# EasyEDA Pro project PCB-PockerMultimater1.epro, board PCB-PockerMultimater1
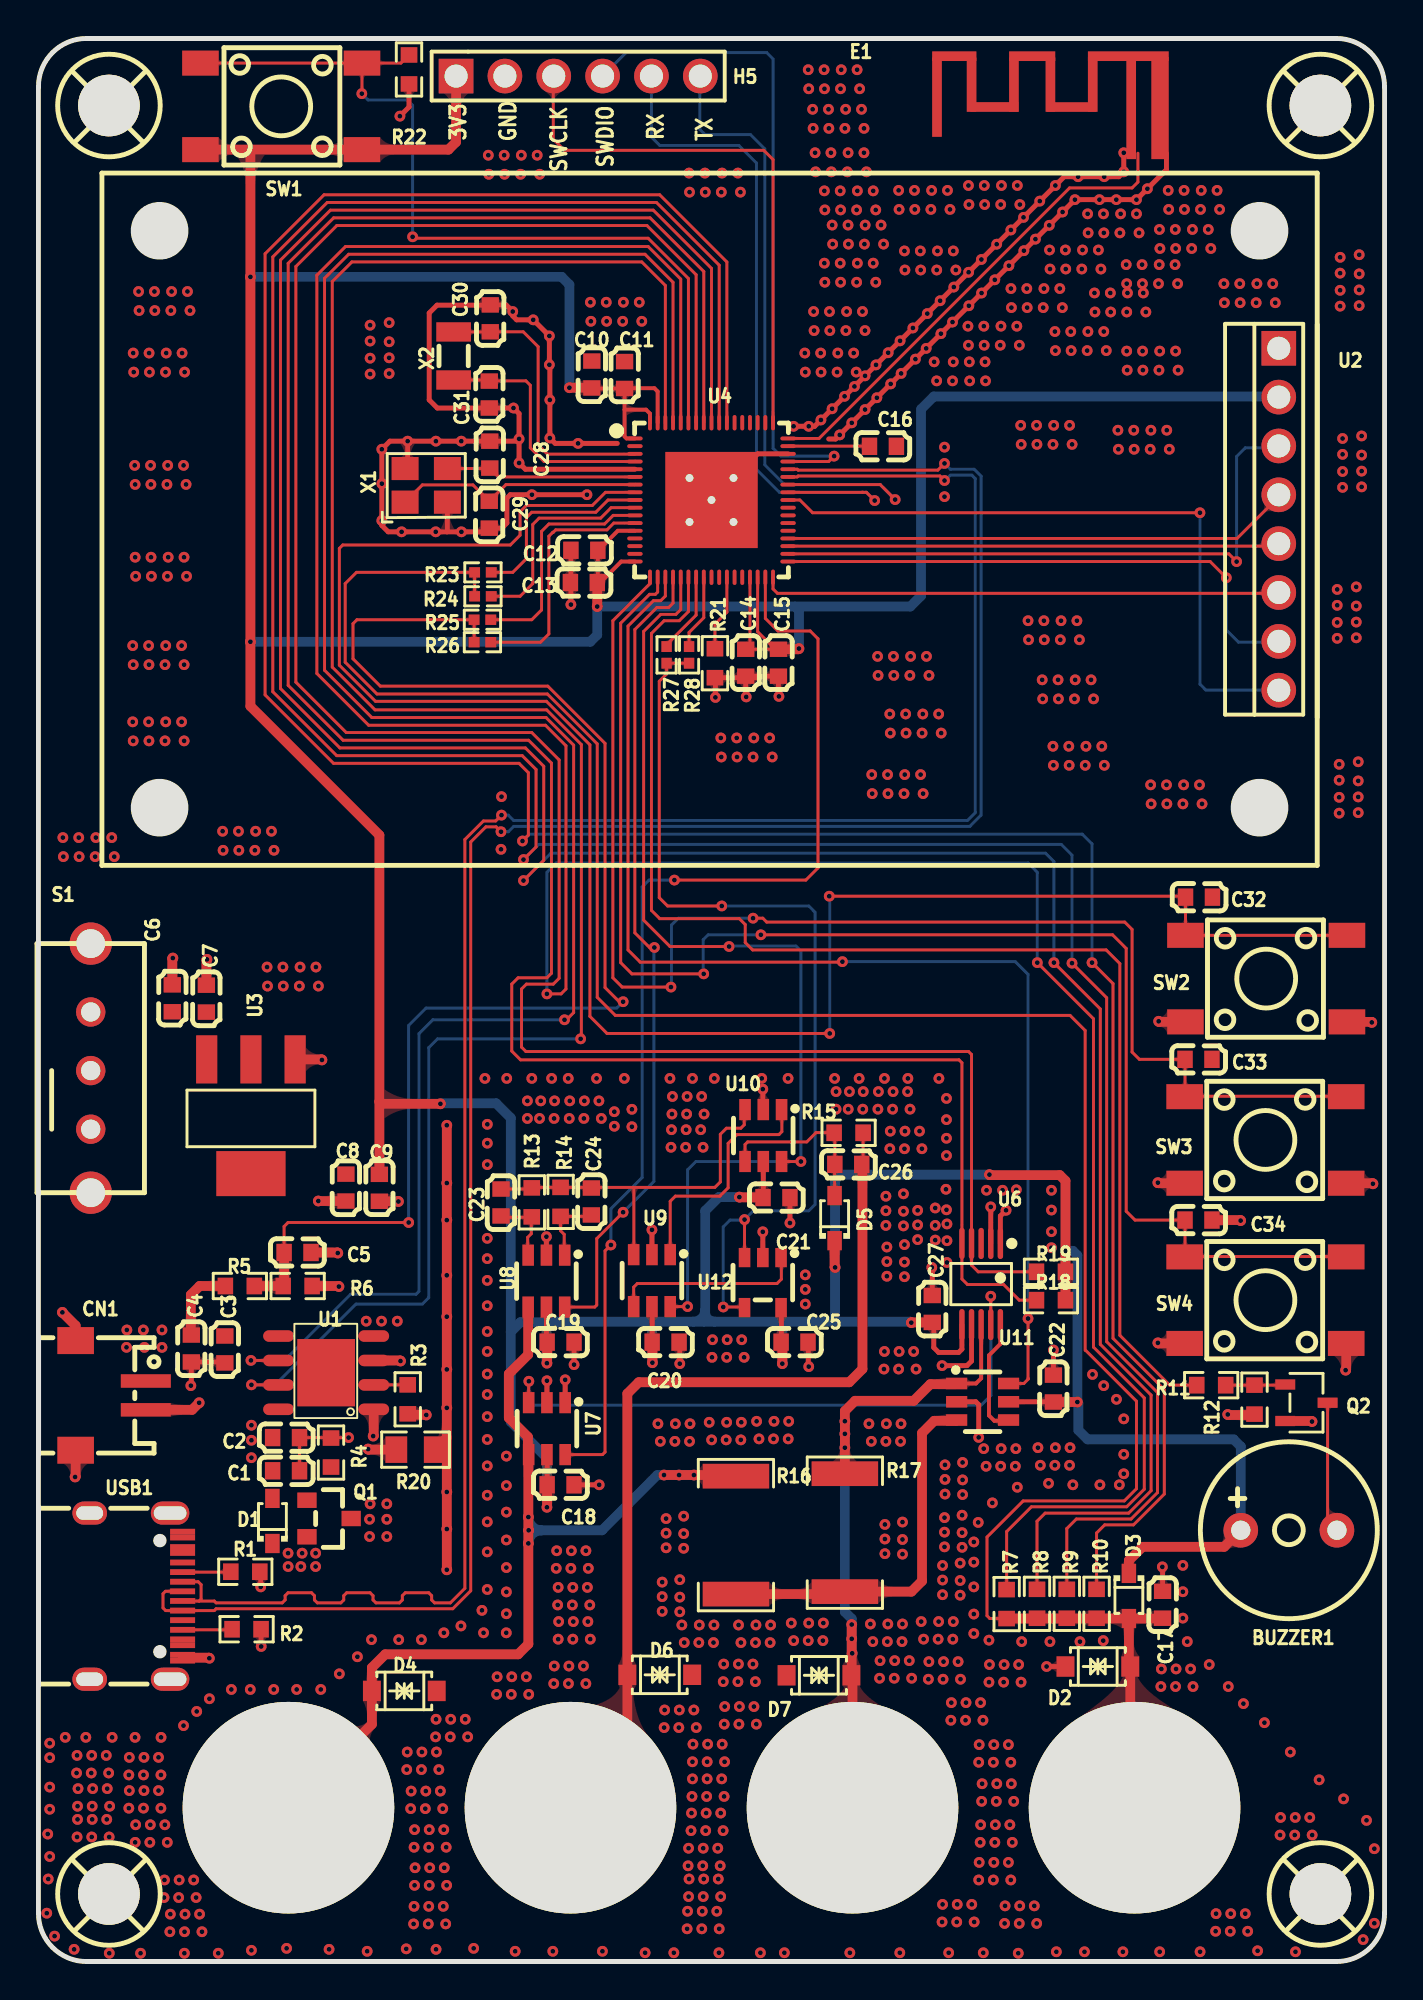
[diagram p0: board, top side]
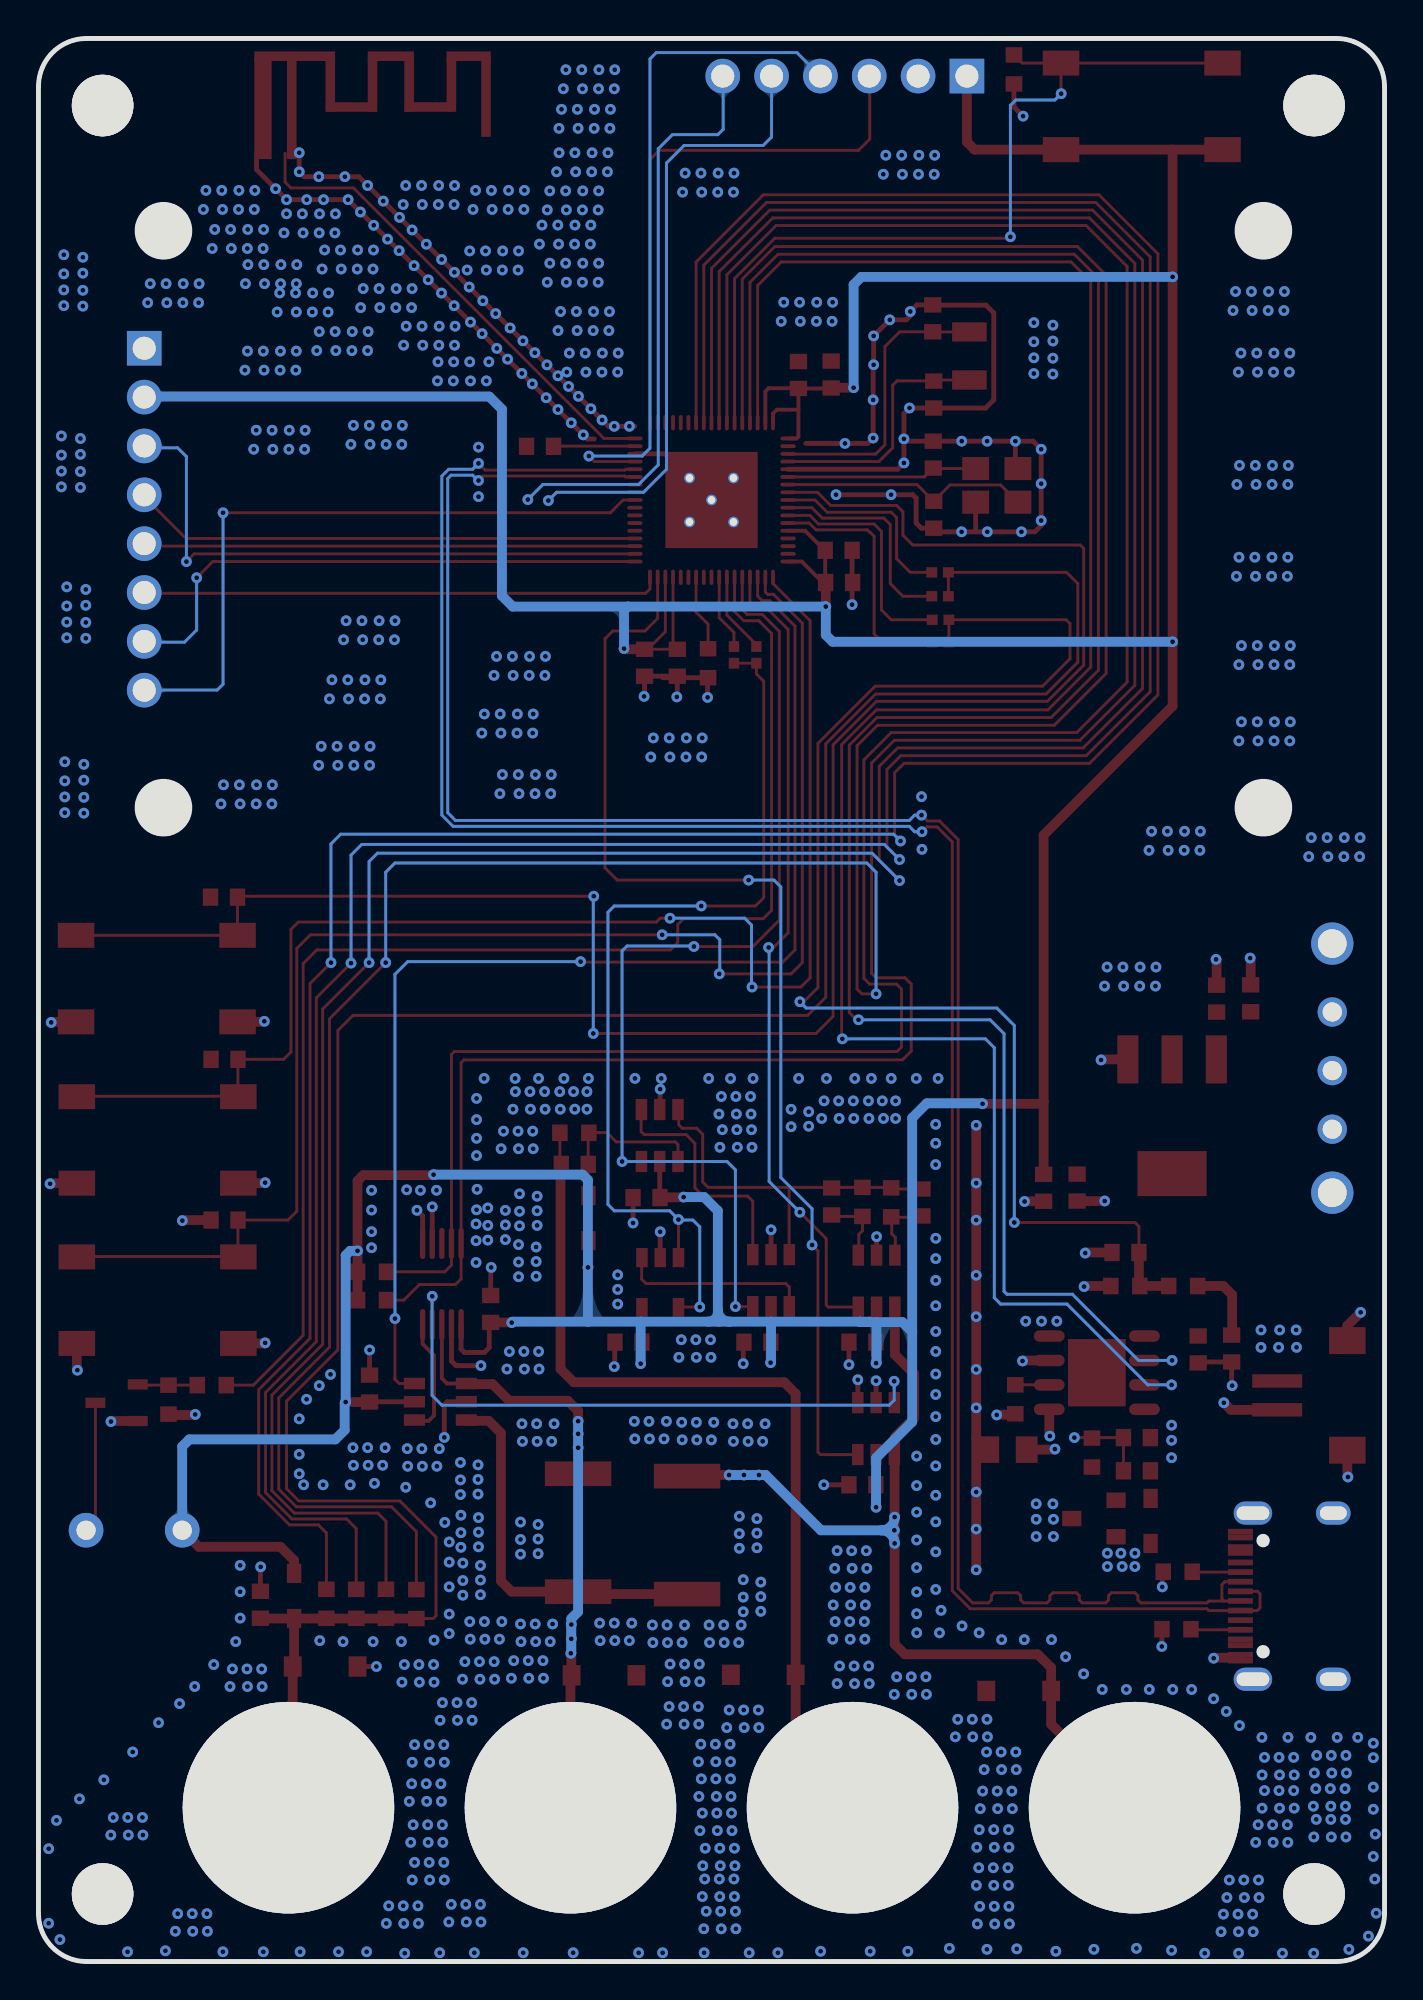
[diagram p1: board, bottom side, seen from below]

Outline 70 x 100 mm; copper layers: Top Layer, Bottom Layer. Coordinates in mm from the lower left corner of the outline.
Outline path: 0,97.5 0,2.5 arc(0.73,0.73) 2.5,0 67.5,0 arc(69.27,0.73) 70,2.5 70,97.5 arc(69.27,99.27) 67.5,100 2.5,100 arc(0.73,99.27) 0,97.5
Stack: Top Layer 0.035mm / Dielectric1 1.51mm FR4 er 4.5 / Bottom Layer 0.035mm

## Design rules (mm)
net VIN: power
net GND: power
net VBUS: power
net USB1DM: DP1
net USB1DP: DP1
net 3V3: power
net VBAT: power
net +5V: power
net AGND: power
template: 自定义配置
spacing copperThickness1oz (default): track to track 0.152, other pairs 0.152 to 0.152
spacing copperThickness2oz: track to track 0.203, other pairs 0.152 to 0.3
spacing ANT: track to track 0.152, other pairs 0 to 0.3
track width copperThickness1oz (default): min 0.152, default 0.152, max 2.54
track width copperThickness2oz: min 0.203, default 0.254, max 2.54
track width power: min 0.152, default 0.254, max 2.54
differential pair differentialPair (default): width min 0.152, default 0.152, max 0.152; gap min 0.152, default 0.152
via viaSize (default): diameter min 0.559, default 0.559, max 0.559; hole min 0.254, default 0.254, max 0.254
net class power uses power
net VIN uses power
net GND uses power
net VBUS uses power
net 3V3 uses power
net VBAT uses power
net +5V uses power
net AGND uses power

## Placement (name value [footprint] x y rotation side)
BUZZER1  3kHz  [BUZ-TH_BD9.0-P5.00-D0.6-FD]  65.02 22.43 0 top
C1  10uF  [C0603]  12.88 25.52 180 top
C2  100nF  [C0603]  12.88 27.25 180 top
C3  10uF  [C0603]  9.69 31.83 90 top
C4  100nF  [C0603]  7.95 31.88 90 top
C5  100nF  [C0603]  13.47 36.87 0 top
C6  10uF  [C0603]  6.96 50.09 270 top
C7  100nF  [C0603]  8.73 50.07 90 top
C8  10uF  [C0603]  15.99 40.25 90 top
C9  100nF  [C0603]  17.73 40.23 270 top
C10  100nF  [C0603]  28.78 82.52 90 top
C11  100nF  [C0603]  30.48 82.5 270 top
C12  100nF  [C0603]  28.39 73.39 180 top
C13  100nF  [C0603]  28.36 71.71 180 top
C14  100nF  [C0603]  36.78 67.54 270 top
C15  100nF  [C0603]  38.48 67.54 270 top
C16  1uF  [C0603]  43.92 78.79 0 top
C17  100nF  [C0603]  58.46 18.55 270 top
C18  100nF  [C0603]  27.15 24.79 0 top
C19  100nF  [C0603]  27.15 32.21 0 top
C20  100nF  [C0603]  32.61 32.21 0 top
C21  100nF  [C0603]  38.38 39.73 0 top
C22  100nF  [C0603]  52.78 29.79 90 top
C23  100nF  [C0603]  24.05 39.47 90 top
C24  100nF  [C0603]  28.75 39.52 90 top
C25  100nF  [C0603]  39.32 32.21 0 top
C26  100nF  [C0603]  42.11 41.45 180 top
C27  100nF  [C0603]  46.48 33.93 90 top
C28  12pF  [C0603]  23.47 78.36 90 top
C29  12pF  [C0603]  23.44 75.23 90 top
C30  12pF  [C0603]  23.5 85.45 90 top
C31  12pF  [C0603]  23.44 81.48 270 top
C32  100nF  [C0603]  60.35 55.35 180 top
C33  100nF  [C0603]  60.32 46.91 180 top
C34  100nF  [C0603]  60.32 38.56 180 top
CN1  1.5K-BH-2PWB  [CONN-SMD_2P-P1.50_HDGC_1.5K-BH-2PWB]  3.76 29.44 270 top
D1  1N5819WS  [SOD-323_L1.8-W1.3-LS2.5-RD]  12.17 22.91 90 top
D2  SJD12C40L01  [SOD-123_L2.8-W1.8-LS3.7-BI]  55.09 15.34 0 top
D3  1N4148  [SOD-323_L1.8-W1.3-LS2.5-RD]  56.71 19.01 270 top
D4  SJD12C40L01  [SOD-123_L2.8-W1.8-LS3.7-BI]  19.02 14.07 180 top
D5  1N4148  [SOD-323_L1.8-W1.3-LS2.5-RD]  41.4 38.66 90 top
D6  SJD12C40L01  [SOD-123_L2.8-W1.8-LS3.7-BI]  32.31 14.91 180 top
D7  SJD12C40L01  [SOD-123_L2.8-W1.8-LS3.7-BI]  40.59 14.88 0 top
E1  d62bb7b376ef4f1495932ffa50be4b9b  [ANT-F-1-2.4G-1.6]  57.18 94.03 0 top
H1  -  [M3]  3.5 96.5 0 top
H2  -  [M3]  66.5 96.5 0 top
H3  -  [M3]  3.5 3.5 0 top
H4  -  [M3]  66.5 3.5 0 top
H5  2.54-1x6P直针  [HDR-TH_6P-P2.54-V-M-1]  28.07 98.04 0 top
J1  -  [香蕉头-4mm-24.302.*]  13 8 0 top
J2  -  [香蕉头-4mm-24.302.*]  27.67 8 0 top
J3  -  [香蕉头-4mm-24.302.*]  42.33 8 0 top
J4  -  [香蕉头-4mm-24.302.*]  57 8 0 top
Q1  AO3401A  [SOT-23_L2.9-W1.3-P1.90-LS2.4-BR]  15.11 23.04 180 top
Q2  S8050  [SOT-23-3_L3.0-W1.7-P0.95-LS2.9-BR]  65.94 29.06 180 top
R1  5.1kΩ  [R0603]  10.76 20.27 180 top
R2  5.1kΩ  [R0603]  10.82 17.28 180 top
R3  10kΩ  [R0603]  19.2 29.24 90 top
R4  10kΩ  [R0603]  15.21 26.47 270 top
R5  10kΩ  [R0603]  10.47 35.13 180 top
R6  10kΩ  [R0603]  13.48 35.13 180 top
R7  1kΩ  [R0603]  50.35 18.59 90 top
R8  10kΩ  [R0603]  51.93 18.6 90 top
R9  100kΩ  [R0603]  53.48 18.6 90 top
R10  1MΩ  [R0603]  55.03 18.6 90 top
R11  10kΩ  [R0603]  60.99 29.97 0 top
R12  10kΩ  [R0603]  63.24 29.22 90 top
R13  100kΩ  [R0603]  25.65 39.48 90 top
R14  1MΩ  [R0603]  27.15 39.5 90 top
R15  1MΩ  [R0603]  42.13 43.09 180 top
R16  10mΩ  [R2512]  36.27 22.17 90 top
R17  80mΩ  [R2512]  41.94 22.3 270 top
R18  4.7kΩ  [R0603]  52.65 34.39 0 top
R19  4.7kΩ  [R0603]  52.65 35.86 0 top
R20  0Ω  [R0805]  19.61 26.62 180 top
R21  10kΩ  [R0603]  35.18 67.51 270 top
R22  10kΩ  [R0603]  19.27 98.39 270 top
R23  0Ω  [R0402]  23.11 72.24 0 top
R24  0Ω  [R0402]  23.11 70.99 0 top
R25  0Ω  [R0402]  23.09 69.77 0 top
R26  0Ω  [R0402]  23.09 68.61 0 top
R27  0Ω  [R0402]  32.66 67.94 90 top
R28  0Ω  [R0402]  33.83 67.94 90 top
S1  SK-12E12-G5  [SW-TH_SK-12E12-G5]  2.72 46.46 180 top
SW1  TS-1002S-07026C  [KEY-SMD_4P-L6.0-W6.0-P4.50-LS9.0]  12.62 96.47 180 top
SW2  TS-1002S-07026C  [KEY-SMD_4P-L6.0-W6.0-P4.50-LS9.0]  63.85 51.11 0 top
SW3  TS-1002S-07026C  [KEY-SMD_4P-L6.0-W6.0-P4.50-LS9.0]  63.81 42.72 0 top
SW4  TS-1002S-07026C  [KEY-SMD_4P-L6.0-W6.0-P4.50-LS9.0]  63.81 34.39 0 top
U1  TP4056X-42-ESOP8  [TP4056-SOP8]  14.96 30.62 0 top
U2  -  [2.0寸TFT屏幕模块-8Pin]  35 75 270 top
U3  AMS1117-3.3  [SOT-223-3_L6.5-W3.4-P2.30-LS7.0-BR]  11.05 43.94 90 top
U4  7693da239a7c4f18baa0651e8e27e4a9  [QFN68(8x8)]  35 76 270 top
U6  INA226AIDGSR  [MSOP-10_L3.0-W3.0-P0.50-LS5.0-BL]  49.02 35.23 180 top
U7  SN74LVC1G3157DBVR  [SOT-23-6_L2.9-W1.6-P0.95-LS2.8-BR]  26.44 27.71 90 top
U8  SN74LVC1G3157DBVR  [SOT-23-6_L2.9-W1.6-P0.95-LS2.8-BR]  26.42 35.38 90 top
U9  SN74LVC1G3157DBVR  [SOT-23-6_L2.9-W1.6-P0.95-LS2.8-BR]  31.9 35.41 90 top
U10  SN74LVC1G3157DBVR  [SOT-23-6_L2.9-W1.6-P0.95-LS2.8-BR]  37.69 42.95 90 top
U11  SN74LVC1G3157DBVR  [SOT-23-6_L2.9-W1.6-P0.95-LS2.8-BR]  49.1 29.11 180 top
U12  LMV321IDBVR  [SOT-23-5_L3.0-W1.7-P0.95-LS2.8-BR]  37.67 35.31 90 top
USB1  KH-TYPE-C-16P  [USB-C-SMD_KH-TYPE-C-16P]  5.08 19 270 top
X1  32MHz  [OSC-SMD_4P-L3.2-W2.5-BL]  20.16 76.76 0 top
X2  32.768kHz  [FC-135R_L3.2-W1.5]  21.59 83.49 90 top

## Footprints (pads in the part's own frame, mm; a bottom-side part is the same pattern mirrored in y, then rotated)
2.0寸TFT屏幕模块-8Pin
  rect 1.8x1.8 hole 1.2: 1(-8.89,29.5)
  round 1.8 hole 1.2: 2(-6.35,29.5) 3(-3.81,29.5) 4(-1.27,29.5) 5(1.27,29.5) 6(3.81,29.5) 7(6.35,29.5) 8(8.89,29.5)
ANT-F-1-2.4G-1.6
  rect 0.8x0.6 smd: 0(1.143,0)
  rect 0.4x0.6 smd: 1(-0.34,0)
BUZ-TH_BD9.0-P5.00-D0.6-FD
  round 1.8 hole 1: 1(-2.5,0) 2(2.5,0)
C0603
  rect 0.8x0.9 smd: 1(-0.7,0) 2(0.7,0)
CONN-SMD_2P-P1.50_HDGC_1.5K-BH-2PWB
  rect 0.7x2.6 smd: 1(-0.75,1.825) 2(0.75,1.825)
  rect 1.4x1.9 smd: 3(2.85,-1.825) 4(-2.85,-1.825)
FC-135R_L3.2-W1.5
  rect 1x1.8 smd: 1(-1.25,0) 2(1.25,0)
HDR-TH_6P-P2.54-V-M-1
  rect 1.8x1.8 hole 1.2: 1(-6.35,0)
  round 1.8 hole 1.2: 2(-3.81,0) 3(-1.27,0) 4(1.27,0) 5(3.81,0) 6(6.35,0)
KEY-SMD_4P-L6.0-W6.0-P4.50-LS9.0
  rect 1.9x1.3 smd: 1(-4.2,2.25) 2(4.2,2.25) 3(-4.2,-2.25) 4(4.2,-2.25)
M3
  round 3.2 hole 3.2: 0(0.165,0.013)
MSOP-10_L3.0-W3.0-P0.50-LS5.0-BL
  oval 0.28x1.62 smd: 1(-1,-2.11) 2(-0.5,-2.11) 3(0,-2.11) 4(0.5,-2.11) 5(1,-2.11) 6(1,2.11) 7(0.5,2.11) 8(0,2.11) 9(-0.5,2.11) 10(-1,2.11)
OSC-SMD_4P-L3.2-W2.5-BL
  rect 1.4x1.2 smd: 1(-1.1,-0.875) 2(1.1,-0.875) 3(1.1,0.875) 4(-1.1,0.875)
QFN68(8x8)
  round 0.559 hole 0.406: 0(-1.143,1.143) 0(-1.143,-1.143) 0(0,0) 0(1.143,1.143) 0(1.143,-1.143)
  rect 5x4.8 smd: 0(0,0)
  oval 0.2x0.8 smd: 1(-3.2,-3.982) 2(-2.8,-3.982) 3(-2.4,-3.982) 4(-2,-3.982) 5(-1.6,-3.982) 6(-1.2,-3.982) 7(-0.8,-3.982) 8(-0.4,-3.982) 9(0,-3.982) 10(0.4,-3.982) 11(0.8,-3.982) 12(1.2,-3.982) 13(1.6,-3.982) 14(2,-3.982) 15(2.4,-3.982) 16(2.8,-3.982) 17(3.2,-3.982) 35(3.2,3.982) 36(2.8,3.982) 37(2.4,3.982) 38(2,3.982) 39(1.6,3.982) 40(1.2,3.982) 41(0.8,3.982) 42(0.4,3.982) 43(0,3.982) 44(-0.4,3.982) 45(-0.8,3.982) 46(-1.2,3.982) 47(-1.6,3.982) 48(-2,3.982) 49(-2.4,3.982) 50(-2.8,3.982) 51(-3.2,3.982)
  oval 0.8x0.2 smd: 18(4.018,-3.2) 19(4.018,-2.8) 20(4.018,-2.4) 21(4.018,-2) 22(4.018,-1.6) 23(4.018,-1.2) 24(4.018,-0.8) 25(4.018,-0.4) 26(4.018,0) 27(4.018,0.4) 28(4.018,0.8) 29(4.018,1.2) 30(4.018,1.6) 31(4.018,2) 32(4.018,2.4) 33(4.018,2.8) 34(4.018,3.2) 52(-4.018,3.2) 53(-4.018,2.8) 54(-4.018,2.4) 55(-4.018,2) 56(-4.018,1.6) 57(-4.018,1.2) 58(-4.018,0.8) 59(-4.018,0.4) 60(-4.018,0) 61(-4.018,-0.4) 62(-4.018,-0.8) 63(-4.018,-1.2) 64(-4.018,-1.6) 65(-4.018,-2) 66(-4.018,-2.4) 67(-4.018,-2.8) 68(-4.018,-3.2)
R0402
  rect 0.566x0.54 smd: 1(-0.433,0) 2(0.433,0)
R0603
  rect 0.806x0.864 smd: 1(-0.753,0) 2(0.753,0)
R0805
  rect 1.133x1.377 smd: 1(-1,0) 2(1,0)
R2512
  rect 1.282x3.456 smd: 1(-3.067,0) 2(3.067,0)
SOD-123_L2.8-W1.8-LS3.7-BI
  rect 0.93x1.06 smd: 1(1.685,0) 2(-1.685,0)
SOD-323_L1.8-W1.3-LS2.5-RD
  rect 1x0.75 smd: 1(-1.173,0) 2(1.173,0)
SOT-23-3_L3.0-W1.7-P0.95-LS2.9-BR
  rect 1.038x0.532 smd: 1(1.101,-0.95) 2(1.101,0.95) 3(-1.101,0)
SOT-23-5_L3.0-W1.7-P0.95-LS2.8-BR
  rect 1x0.6 smd: 1(1.3,-0.95) 2(1.3,0) 3(1.3,0.95) 4(-1.3,0.95) 5(-1.3,-0.95)
SOT-23-6_L2.9-W1.6-P0.95-LS2.8-BR
  rect 1.1x0.6 smd: 1(1.35,-0.95) 2(1.35,0) 3(1.35,0.95) 4(-1.35,0.95) 5(-1.35,0) 6(-1.35,-0.95)
SOT-23_L2.9-W1.3-P1.90-LS2.4-BR
  rect 1x0.8 smd: 1(1.15,-0.95) 2(1.15,0.95) 3(-1.15,0)
SOT-223-3_L6.5-W3.4-P2.30-LS7.0-BR
  rect 2.5x1.1 smd: 1(2.97,-2.3) 2(2.97,0) 3(2.97,2.3)
  rect 2.34x3.6 smd: 4(-2.97,0)
SW-TH_SK-12E12-G5
  round 1.524 hole 1: 1(0,3.175) 2(0,0.127) 3(0,-2.921)
  round 2.2 hole 1.5: 4(0,-6.477) 5(0,6.477)
TP4056-SOP8
  oval 1.6x0.6 smd: 1(2.475,-1.905) 2(2.475,-0.635) 3(2.475,0.635) 4(2.475,1.905) 5(-2.475,1.905) 6(-2.475,0.635) 7(-2.475,-0.635) 8(-2.475,-1.905)
  rect 3x3.5 smd: 9(0,0)
USB-C-SMD_KH-TYPE-C-16P
  oval 1.2x2 hole 0.7x1.7: 1(-4.32,1.765) 2(4.32,1.765)
  oval 1.2x1.8 hole 0.7x1.4: 3(-4.32,-2.415) 4(4.32,-2.415)
  rect 0.3x1.3 smd: A1(-3.35,2.415) A4(-2.55,2.415) A5(-1.25,2.415) A6(-0.25,2.415) A7(0.25,2.415) A8(1.25,2.415) A9(2.55,2.415) A12(3.35,2.415) B1(3.05,2.415) B4(2.25,2.415) B5(1.75,2.415) B6(0.75,2.415) B7(-0.75,2.415) B8(-1.75,2.415) B9(-2.25,2.415) B12(-3.05,2.415)
香蕉头-4mm-24.302.*
  round 11 hole 12.2x6.1: 1(0,0)

## Nets
3V3: BUZZER1.1 C8.2 C9.1 C10.1 C11.2 C12.1 C13.1 C14.1 C15.1 C18.1 C19.1 C20.1 C21.1 C22.1 C25.1 C27.1 D3.1 D5.1 H5.1 R18.2 R19.2 SW1.1 SW1.2 U2.2 U3.2 U3.4 U4.1 U4.13 U4.17 U4.31 U4.32 U4.67 U4.68 U6.6 U7.5 U8.5 U9.5 U10.5 U11.5 U12.5
+5V: D1.1 Q1.2 S1.2
AGND: C17.1 C18.2 C19.2 C20.2 C21.2 C22.2 C25.2 C27.2 D2.2 D4.2 D6.2 D7.2 R20.1 U6.1 U6.2 U6.7 U7.1 U7.2 U8.2 U9.2 U10.2 U11.2 U12.2
GND: C1.1 C2.1 C3.1 C4.1 C5.2 C6.1 C7.2 C8.1 C9.2 C10.2 C11.1 C12.2 C13.2 C14.2 C15.2 C16.2 C28.2 C29.1 C30.2 C31.2 C32.1 C33.1 C34.1 CN1.2 CN1.3 CN1.4 H5.2 Q2.2 R1.1 R2.1 R3.1 R4.1 R6.1 R12.1 R20.2 R21.2 R22.2 S1.4 S1.5 SW2.3 SW2.4 SW3.3 SW3.4 SW4.3 SW4.4 U1.1 U1.3 U1.9 U2.1 U3.1 U4.0 U4.5 U4.49 USB1.1 USB1.2 USB1.3 USB1.4 USB1.A1 USB1.A12 USB1.B1 USB1.B12 X1.2 X1.4
VBAT: C3.2 C4.2 CN1.1 Q1.3 R5.2 U1.5
VBUS: C1.2 C2.2 D1.2 Q1.1 R4.2 U1.4 U1.8 USB1.A4 USB1.A9 USB1.B4 USB1.B9
VIN: D7.1 J3.1 R17.1 U6.8 U11.1
VINTA: C16.1 U4.50
ADC_VBAT: C5.1 R5.1 R6.2 R25.1 R26.1
ADC_VOLTAGE: R27.1 R28.1 U12.3 U12.4
ANT: E1.1 U4.51
BOOT0: R22.1 SW1.3 SW1.4 U4.63
BOOT1: R21.1 U4.28
BUZZER: R11.1 U4.23
CC1: R1.2 USB1.A5
CC2: R2.2 USB1.B5
CHRG: U1.7 U4.66
HOLD: C33.2 SW3.1 SW3.2 U4.18
INA_SCL: R18.1 U4.61 U6.5
INA_SDA: R19.1 U4.62 U6.4
LCD_BLK: U2.8 U4.43
LCD_CS: U2.7 U4.35
LCD_DC: U2.6 U4.34
LCD_RES: U2.5 U4.37
LCD_SCL: U2.3 U4.36
LCD_SDA: U2.4 U4.38
LINK_RX: H5.5 U4.44
LINK_TX: H5.6 U4.45
MODE: C34.2 SW4.1 SW4.2 U4.19
NRST: C32.2 SW2.1 SW2.2 U4.8
OSC32IN: C30.1 U4.3 X2.2
OSC32OUT: C31.1 U4.4 X2.1
OSC_IN: C28.1 U4.6 X1.3
OSC_OUT: C29.2 U4.7 X1.1
REF: U6.9 U7.3
RES: C17.2 D2.1 D3.2 J4.1 R7.1 R8.1 R9.1 R10.1 R23.1 R24.1
RES_1: R7.2 U4.64
RES_2: R8.2 U4.60
RES_3: R9.2 U4.59
RES_4: R10.2 U4.58
SEL_CURRENT: U4.20 U11.6
SEL_OF: U4.33 U7.6
SEL_VOLTAGE_0: U4.21 U8.6
SEL_VOLTAGE_1: U4.22 U9.6 U10.6
STDBY: U1.6 U4.65
SWCLK: H5.3 U4.52
SWDIO: H5.4 U4.48
USB1DM: U4.46 USB1.A7 USB1.B7
USB1DP: U4.47 USB1.A6 USB1.B6
$1N2724: R3.2 U1.2
$1N6482: U9.4 U12.1
$1N6484: R16.1 R17.2 U11.3
$1N6487: D4.1 J1.1 R16.2 U7.4 U8.4
$1N6488: C26.1 D6.1 J2.1 R15.1
$1N6489: C26.2 D5.2 R15.2 U10.4
$1N6490: C24.1 R14.1 U8.1
$1N6491: C23.1 R13.1 U8.3
$1N6508: C23.2 C24.2 R13.2 R14.2 U9.3 U10.3
$1N6517: U9.1 U10.1
$1N9045: U6.10 U11.4
$1N10212: R23.2 U4.9
$1N10257: R24.2 U4.10
$1N10302: R25.2 U4.11
$1N10388: R26.2 U4.12
$1N10482: R27.2 U4.24
$1N10485: R28.2 U4.25
$1N25880: C6.2 C7.1 S1.3 U3.3
$1N61600: BUZZER1.2 Q2.3
$1N61623: Q2.1 R11.2 R12.2

Pads without a net: E1 0; H1 0; H2 0; H3 0; H4 0; S1 1; U4 2 14 15 16 26 27 29 30 39 40 41 42 53 54 55 56 57; U6 3; USB1 A8 B8

## Via types
v1: diameter 0.559, hole 0.254, Top Layer to Bottom Layer, 1220 vias

## Routing (per net, layer and track width the routed paths; a pad name or vN(x,y) marks a point on that pad's centre or on a via; arc(x,y) is an arc through that point)
3V3: length 339.6
  Top Layer w0.152: 38.31,68.24 C14.1 37,68.46 U4.31 ; 38.31,68.24 37.4,69.15 U4.32 ; 38.31,68.24 C15.1
  Top Layer w0.203: U4.17 30.31,72.8 29.21,71.71 C13.1 29.09,71.73 C12.1 29.11,73.39 30.13,74.4 U4.13 ; 30.48,80.7 30.48,81.8 ; 30.48,80.7 30.48,79.3 30.58,79.2 U4.1 ; 30.48,80.7 31.6,80.7 31.8,80.49 U4.68 ; 30.48,81.8 30.49,81.81 32.03,81.81 32.2,81.64 U4.67 ; 30.48,81.8 28.87,81.8 28.84,81.82 C10.1
  Top Layer w0.254: C19.1 26.42,32.24 U8.5 ; C21.1 37.69,39.74 U10.5 ; 38.63,32.2 38.63,33.99 U12.5 ; U11.5 52.77,29.11 C22.1 ; U7.5 26.45,26.35 C18.1 ; U6.6 48.02,31.84 47.85,31.67 46.81,31.67 46.56,31.93 46.56,33.11 46.53,33.08 46.15,33.08 ; U9.5 31.91,34.05 C20.1
  Top Layer w0.508: C9.1 17.73,44.72 ; 17.73,44.72 17.84,44.6 v1(20.9,44.6) ; 17.73,44.72 17.73,58.57 11.02,65.28 v1(11.02,68.63) v1(11.02,87.6) 11.02,94.22 ; H5.1 21.72,94.61 21.32,94.22 SW1.1 11.02,94.22 ; v1(45.39,33.22) 45.4,33.23 C27.1 ; C13.1 29.06,71.7 v1(29.06,70.46) ; R18.2 R19.2 v1(53.41,36.96) 53.41,40.6 53.11,40.89 49.48,40.89 v1(49.45,40.92) ; C22.1 v1(54.03,29.09) ; 37.69,39.74 36.46,39.74 v1(36.45,39.75) ; v1(39.55,68.28) 39.51,68.24 C15.1 ; D3.1 56.71,20.86 57.41,21.56 61.66,21.56 BUZZER1.1 ; C20.1 31.93,32.19 v1(31.93,31.14) ; SW1.2 11.02,94.22 ; 38.63,32.2 38.68,32.14 v1(38.68,31.09) ; v1(27.61,81.84) 28.76,81.84 C10.1 ; 26.44,24.78 C18.1 26.45,23.63 v1(26.44,23.62) ; C19.1 26.45,31.13 v1(26.44,31.12) ; v1(41.43,36.09) 41.4,36.12 D5.1
  Bottom Layer w0.508: 34.67,33.88 34.67,39.04 35.38,39.75 v1(36.45,39.75) ; 34.67,33.88 34.67,33.76 ; 34.67,33.88 arc(34.49,33.45) 34.06,33.27 ; 26.75,33.25 26.42,33.25 ; 26.75,33.25 26.77,33.27 27.28,33.27 ; 26.75,33.25 27.25,33.25 27.28,33.27 ; 26.42,33.25 26.42,31.14 v1(26.44,31.12) ; 26.42,33.25 25.07,33.25 24.56,32.74 ; v1(26.44,23.62) 26.44,26.19 24.56,28.07 24.56,32.74 ; v1(45.39,33.22) 45.34,33.27 41.43,33.27 ; v1(39.55,68.28) 39.55,70.26 39.34,70.46 ; 34.67,33.76 34.67,33.33 34.61,33.27 ; 34.67,33.76 arc(34.81,33.42) 35.16,33.27 ; 39.34,70.46 45.34,70.46 45.9,71.02 45.9,80.72 46.56,81.38 64.57,81.38 64.6,81.35 ; 39.34,70.46 v1(29.06,70.46) 29.06,68.99 28.7,68.63 v1(11.02,68.63) ; 41.43,33.27 38.68,33.27 ; 41.43,33.27 v1(41.43,36.09) 41.43,40.64 41.71,40.92 v1(49.45,40.92) ; 24.56,32.74 24.56,43.87 23.8,44.63 20.93,44.63 v1(20.9,44.6) ; 34.61,33.27 35.16,33.27 ; 34.61,33.27 34.06,33.27 ; v1(31.93,31.14) 31.9,31.17 31.9,33.27 ; 38.68,33.27 35.16,33.27 ; 38.68,33.27 v1(38.68,31.09) ; BUZZER1.1 62.52,26.78 62.15,27.15 54.56,27.15 54.08,27.63 54.08,29.04 v1(54.03,29.09) 54.03,36.72 53.79,36.96 v1(53.41,36.96) ; 27.28,33.27 31.9,33.27 ; v1(27.61,81.84) 27.61,87.2 27.21,87.6 v1(11.02,87.6) ; 34.06,33.27 31.9,33.27
+5V:
  vias: v1(12.98,21.23) v1(12.98,20.54) v1(13.64,20.54) v1(13.71,21.23) v1(14.41,21.23) v1(14.41,20.54)
AGND: length 52.5
  Top Layer w0.254: C17.1 58.46,20.51 v1(58.45,20.52) ; U9.2 v1(31.9,38.05) ; U7.2 v1(26.44,30.2) ; v1(48.9,27.25) 48.9,28.96 48.74,29.11 U11.2 ; v1(46.99,30.99) 48.29,30.99 48.52,31.22 U6.7 ; v1(40.06,30.94) 40.03,30.96 40.03,32.2 ; C22.2 v1(52.78,31.8) ; U7.1 v1(27.39,30.25) ; C20.2 33.35,32.17 v1(33.35,31.09) ; C27.2 46.48,36.07 v1(46.46,36.09) ; U8.2 v1(26.42,37.69) ; v1(50.32,39.06) 50.02,38.77 U6.1 ; v1(37.67,45.36) 37.67,44.33 U10.2 ; C19.2 v1(27.85,31.04) ; 27.8,24.79 v1(29.16,24.79) ; D2.2 v1(52.43,15.34) ; C21.2 v1(39.08,38.41) ; U12.2 v1(37.67,37.95) ; U6.2 v1(49.52,39.24)
  Top Layer w0.508: v1(21.23,20.37) v1(21.23,22.49) v1(21.23,24.42) 21.23,27.25 ; R20.1 21.23,27.25 ; 21.23,27.25 v1(21.23,28.79) v1(21.23,30.79) v1(21.23,33.53) v1(21.23,35.68) v1(21.23,38.55) v1(21.23,40.48) v1(21.23,43.48)
  Bottom Layer w0.254: v1(37.67,45.36) 37.67,45.29
  vias: v1(0.43,2.51) v1(0.48,6.63) v1(0.51,4.29) v1(0.58,11.35) v1(0.58,10.6) v1(0.58,9.07) v1(0.58,7.92) v1(0.58,5.46) v1(0.84,1.32) v1(1.39,11.66) v1(1.85,0.63) v1(2.01,10.72) v1(1.98,9.8) v1(2.03,8.08) v1(2.03,7.39) v1(2.01,6.48) v1(2.06,8.99) v1(2.46,11.66) v1(2.74,9.8) v1(2.77,10.72) v1(2.82,8.99) v1(2.8,8.08) v1(2.8,7.39) v1(2.77,6.48) v1(3.53,10.72) v1(3.58,8.99) v1(3.55,7.39) v1(3.65,9.8) v1(3.7,8.08) v1(3.68,6.48) v1(3.68,0.43) v1(3.83,11.66) v1(4.72,10.62) v1(4.7,9.7) v1(4.72,8.89) v1(4.7,7.98) v1(5.02,11.66) v1(5.03,6.2) v1(5.05,7.11) v1(5.31,0.43) v1(5.49,10.62) v1(5.46,9.7) v1(5.49,8.89) v1(5.46,7.98) v1(5.82,7.11) v1(5.79,6.2) v1(6.24,10.62) v1(6.24,8.89) v1(6.38,11.66) v1(6.37,9.7) v1(6.37,7.98) v1(6.53,3.33) v1(6.57,7.11) v1(6.55,4.24) v1(6.7,6.2) v1(6.83,1.55) v1(6.86,2.46) v1(7.32,4.24) v1(7.29,3.33) v1(7.54,12.27) v1(7.62,2.46) v1(7.6,1.55) v1(7.59,0.43) v1(8.07,4.24) v1(8.23,13) v1(8.2,3.33) v1(8.38,2.46) v1(8.5,1.55) v1(8.89,13.66) v1(9.35,0.43) v1(10.03,14.15) v1(11.02,14.15) v1(11.07,0.58) v1(12.23,14.15) v1(12.9,0.69) v1(13.43,14.15) v1(14.68,14.15) v1(15.11,0.63) v1(15.65,14.96) v1(16.59,15.85) v1(17.09,0.53) v1(17.32,16.74) v1(18.73,16.74) v1(19.13,0.66) v1(19.18,10.9) v1(19.15,9.98) v1(19.38,8.86) v1(19.35,7.95) v1(19.53,5.94) v1(19.53,2.87) v1(19.51,1.96) v1(19.56,6.86) v1(19.58,4.88) v1(19.56,3.96) v1(19.91,16.74) v1(19.94,10.9) v1(19.91,9.98) v1(20.14,8.86) v1(20.12,7.95) v1(20.32,6.86) v1(20.3,5.94) v1(20.35,4.88) v1(20.32,3.96) v1(20.3,2.87) v1(20.27,1.96) v1(20.68,12.6) v1(20.65,11.68) v1(20.7,10.9) v1(20.68,0.63) v1(20.82,9.98) v1(20.9,8.86) v1(21.02,7.95) v1(21.08,17.09) v1(21.08,6.86) v1(21.1,4.88) v1(21.05,2.87) v1(21.2,5.94) v1(21.23,3.96) v1(21.18,1.96) v1(21.44,12.6) v1(21.41,11.68) v1(21.97,17.45) v1(22.19,12.6) v1(22.32,11.68) v1(22.63,0.69) v1(23.06,18.26) v1(23.15,17.09) v1(23.22,45.92) v1(23.34,43.54) v1(23.34,42.55) v1(23.34,41.44) v1(23.34,37.61) v1(23.34,36.55) v1(23.34,35.42) v1(23.34,34.1) v1(23.34,32.76) v1(23.34,31.72) v1(23.34,30.55) v1(23.34,29.49) v1(23.34,28.34) v1(23.34,27.15) v1(23.34,25.77) v1(23.34,24.25) v1(23.34,22.86) v1(23.34,21.3) v1(23.34,19.35) v1(23.83,13.89) v1(23.85,14.81) v1(24.33,26.28) v1(24.33,24.75) v1(24.33,23.37) v1(24.33,21.92) v1(24.33,20.49) v1(24.33,19.22) v1(24.33,18.09) v1(24.33,17.09) v1(24.35,45.92) v1(24.61,14.81) v1(24.59,13.89) v1(24.79,0.53) v1(25.43,44.75) v1(25.43,43.84) v1(25.37,14.81) v1(25.5,13.89) v1(25.66,45.92) v1(26.12,44.75) v1(26.06,43.84) v1(26.69,45.92) v1(26.75,0.53) v1(26.84,44.75) v1(26.81,43.84) v1(26.82,15.37) v1(26.8,14.45) v1(26.95,21.36) v1(26.92,20.45) v1(27.03,19.46) v1(27,18.54) v1(27.03,16.76) v1(27.05,17.68) v1(27.55,45.92) v1(27.63,44.75) v1(27.6,43.84) v1(27.59,15.37) v1(27.56,14.45) v1(27.71,21.36) v1(27.69,20.45) v1(27.79,19.46) v1(27.76,18.54) v1(27.81,17.68) v1(27.79,16.76) v1(28.34,15.37) v1(28.39,44.75) v1(28.36,43.84) v1(28.47,21.36) v1(28.54,19.46) v1(28.47,14.45) v1(28.59,20.45) v1(28.57,17.68) v1(28.67,18.54) v1(28.7,16.76) v1(29.02,45.92) v1(29.15,44.75) v1(29.27,43.84) v1(29.33,0.53) v1(29.95,44.19) v1(29.95,43.44) v1(30.47,45.92) v1(30.86,44.32) v1(30.86,43.41) v1(31.55,0.46) v1(32.21,27.97) v1(32.34,27.05) v1(32.44,19.73) v1(32.44,18.97) v1(32.44,18.21) v1(32.54,12.17) v1(32.64,23.03) v1(32.64,22.28) v1(32.64,21.51) v1(32.56,13.08) v1(32.84,45.92) v1(32.94,44.07) v1(32.92,43.26) v1(32.89,42.34) v1(32.97,44.98) v1(33.04,0.46) v1(33.12,27.97) v1(33.1,27.05) v1(33.35,19.86) v1(33.35,18.95) v1(33.35,18.19) v1(33.33,13.08) v1(33.3,12.17) v1(33.46,17.5) v1(33.55,23.16) v1(33.55,22.25) v1(33.55,21.49) v1(33.58,16.59) v1(33.73,44.98) v1(33.71,44.07) v1(33.68,43.26) v1(33.66,42.34) v1(33.73,1.7) v1(33.81,5.89) v1(33.78,4.98) v1(33.83,4.29) v1(33.81,3.38) v1(33.76,2.62) v1(33.88,27.97) v1(33.86,27.05) v1(33.94,6.81) v1(34.01,45.92) v1(34.04,11.3) v1(34.01,10.39) v1(34.01,9.5) v1(33.99,8.59) v1(33.96,7.72) v1(34.08,13.08) v1(34.21,12.17) v1(34.34,16.59) v1(34.44,43.26) v1(34.37,17.5) v1(34.49,44.98) v1(34.54,4.98) v1(34.52,2.62) v1(34.49,1.7) v1(34.61,44.07) v1(34.56,42.34) v1(34.57,5.89) v1(34.6,4.29) v1(34.57,3.38) v1(34.75,8.59) v1(34.72,7.72) v1(34.7,6.81) v1(34.8,11.3) v1(34.77,10.39) v1(34.77,9.5) v1(34.88,28.04) v1(35.03,31.42) v1(35.01,27.13) v1(35.15,45.92) v1(35.05,32.33) v1(35.13,17.5) v1(35.1,16.59) v1(35.33,5.89) v1(35.28,2.62) v1(35.35,4.29) v1(35.4,1.7) v1(35.39,0.46) v1(35.53,9.5) v1(35.48,7.72) v1(35.45,4.98) v1(35.48,3.38) v1(35.64,15.47) v1(35.61,14.55) v1(35.56,11.3) v1(35.6,6.81) v1(35.69,13.26) v1(35.66,12.34) v1(35.68,10.39) v1(35.66,8.59) v1(35.81,32.33) v1(35.79,31.42) v1(35.79,28.04) v1(35.76,27.13) v1(36.41,17.5) v1(36.4,15.47) v1(36.37,14.55) v1(36.45,13.26) v1(36.43,12.34) v1(36.53,27.13) v1(36.53,16.59) v1(36.57,32.33) v1(36.55,28.04) v1(36.7,31.42) v1(37.16,15.47) v1(37.21,13.26) v1(37.34,28.09) v1(37.31,17.5) v1(37.29,16.59) v1(37.28,14.55) v1(37.33,12.34) v1(37.47,27.18) v1(37.54,0.46) v1(37.61,45.92) v1(38.05,16.59) v1(38.07,17.5) v1(38.23,27.18) v1(38.25,28.09) v1(38.79,0.46) v1(38.98,45.92) v1(39.01,28.09) v1(38.99,27.18) v1(39.15,17.6) v1(39.27,16.69) v1(39.88,35.71) v1(39.88,34.95) v1(39.88,34.19) v1(40.03,16.69) v1(40.05,17.6) v1(40.82,17.6) v1(40.79,16.69) v1(41.4,45.92) v1(41.48,45.24) v1(41.48,44.32) v1(42.11,44.32) v1(42.17,45.24) v1(42.19,0.46) v1(42.68,45.92) v1(42.89,45.24) v1(42.87,44.32) v1(43.19,27.97) v1(43.31,27.05) v1(43.26,17.55) v1(43.39,16.64) v1(43.68,45.24) v1(43.65,44.32) v1(43.74,14.73) v1(43.76,15.65) v1(43.99,45.92) v1(43.99,31.72) v1(43.97,30.81) v1(44.02,22.73) v1(44.02,21.97) v1(44.02,21.21) v1(44.07,39.8) v1(44.07,39.04) v1(44.07,38.28) v1(44.12,37.16) v1(44.12,36.4) v1(44.12,35.64) v1(44.09,27.97) v1(44.07,27.05) v1(44.14,16.64) v1(44.17,17.55) v1(44.3,43.18) v1(44.27,42.27) v1(44.44,45.24) v1(44.42,44.32) v1(44.53,15.65) v1(44.5,14.73) v1(44.73,30.81) v1(44.76,31.72) v1(44.83,27.05) v1(44.79,0.46) v1(44.86,27.97) v1(44.93,22.85) v1(44.93,21.95) v1(44.93,21.18) v1(44.93,17.55) v1(44.91,16.64) v1(45.04,42.27) v1(44.98,39.92) v1(44.98,39.02) v1(44.98,38.25) v1(45.03,37.28) v1(45.03,36.37) v1(45.03,35.61) v1(45.06,43.18) v1(45.21,45.92) v1(45.2,45.24) v1(45.32,44.32) v1(45.28,15.65) v1(45.41,14.73) v1(45.51,31.72) v1(45.64,30.81) v1(45.72,39.06) v1(45.72,38.3) v1(45.72,37.54) v1(45.82,43.18) v1(45.94,42.27) v1(45.9,17.68) v1(46.03,16.76) v1(46.3,15.6) v1(46.28,14.68) v1(46.63,39.19) v1(46.63,38.28) v1(46.63,37.52) v1(46.82,45.92) v1(46.81,17.68) v1(46.79,16.76) v1(47.02,20.59) v1(47.02,19.84) v1(47.02,19.08) v1(47.04,14.68) v1(47.02,2.97) v1(46.99,2.06) v1(47.14,25.83) v1(47.14,25.07) v1(47.14,24.31) v1(47.12,23.08) v1(47.12,22.33) v1(47.12,21.56) v1(47.07,15.6) v1(47.22,44.88) v1(47.22,43.78) v1(47.22,42.81) v1(47.22,41.91) v1(47.19,40.16) v1(47.22,39.09) v1(47.24,38.35) v1(47.24,37.48) v1(47.24,36.35) v1(47.33,0.46) v1(47.45,12.55) v1(47.55,16.76) v1(47.47,13.46) v1(47.57,17.68) v1(47.82,15.6) v1(47.78,2.97) v1(47.75,2.06) v1(47.93,20.72) v1(47.93,19.81) v1(47.93,19.05) v1(47.95,14.68) v1(48.03,23.21) v1(48.03,22.3) v1(48.03,21.54) v1(48.06,25.95) v1(48.06,25.05) v1(48.06,24.28) v1(48.24,13.46) v1(48.21,12.55) v1(48.53,2.97) v1(48.64,21.82) v1(48.64,20.77) v1(48.64,19.48) v1(48.64,18.07) v1(48.64,17.06) v1(48.66,2.06) v1(48.87,22.83) v1(48.92,11.28) v1(48.9,10.36) v1(48.92,5.16) v1(48.9,4.24) v1(48.99,13.46) v1(49.05,8.33) v1(49,7.11) v1(48.97,6.2) v1(49.12,12.55) v1(49.07,9.25) v1(49.13,0.46) v1(49.16,26.67) v1(49.3,40.11) v1(49.28,25.76) v1(49.43,16.71) v1(49.43,14.53) v1(49.45,15.44) v1(49.61,23.85) v1(49.68,11.28) v1(49.66,10.36) v1(49.73,6.2) v1(49.68,5.16) v1(49.66,4.24) v1(49.84,9.25) v1(49.81,8.33) v1(49.76,7.11) v1(50.04,25.76) v1(50.14,40.11) v1(50.06,26.67) v1(50.22,15.44) v1(50.19,14.53) v1(50.24,1.98) v1(50.27,2.9) v1(50.44,11.28) v1(50.44,5.16) v1(50.52,7.11) v1(50.56,10.36) v1(50.59,9.25) v1(50.64,6.2) v1(50.56,4.24) v1(50.72,8.33) v1(50.82,26.67) v1(50.8,25.76) v1(50.85,40.13) v1(50.9,24.66) v1(50.97,15.44) v1(51.03,2.9) v1(51,1.98) v1(50.95,0.43) v1(51.13,16.64) v1(51.1,14.53) v1(51.79,2.9) v1(51.91,1.98) v1(51.97,26.72) v1(52.1,25.81) v1(52.53,24.87) v1(52.6,16.64) v1(52.68,40.11) v1(52.68,39.08) v1(52.68,37.95) v1(52.68,37.12) v1(52.88,26.72) v1(52.86,25.81) v1(52.93,0.51) v1(53.64,26.72) v1(53.62,25.81) v1(53.79,24.79) v1(54.16,16.64) v1(54.4,0.51) v1(54.81,30.53) v1(55.2,24.79) v1(55.4,29.95) v1(55.37,16.69) v1(56.06,29.24) v1(56.21,24.79) v1(56.44,28.22) v1(56.44,26.38) v1(56.44,25.36) v1(56.39,0.51) v1(58.31,0.51) v1(58.39,15.21) v1(58.37,14.3) v1(59.13,14.3) v1(59.16,15.21) v1(59.51,20.6) v1(59.51,19.23) v1(59.51,17.86) v1(59.74,16.64) v1(59.91,15.21) v1(60.04,14.3) v1(60.41,0.51) v1(60.88,15.44) v1(61.24,2.49) v1(61.21,1.57) v1(61.87,14.3) v1(62,2.49) v1(61.98,1.57) v1(62.66,13.41) v1(62.76,2.49) v1(62.88,1.57) v1(63.4,0.56) v1(63.75,12.42) v1(64.59,7.49) v1(64.57,6.58) v1(65.1,10.9) v1(65.33,6.58) v1(65.35,7.49) v1(65.37,0.51) v1(66.11,7.49) v1(66.24,6.58) v1(66.6,9.45) v1(67.87,8.46) v1(68.88,1.14) v1(69.06,7.34) v1(69.47,5.87) v1(69.47,1.99)
GND: length 169.9
  Top Layer w0.152: 15.19,27.25 v1(16.13,27.25) ; 15.19,27.25 R4.1 ; 15.19,27.25 C2.1 C1.1
  Top Layer w0.254: 36.78,66.76 36.78,65.79 v1(36.8,65.76) ; 36.78,66.76 C14.2 37.59,66.84 ; 36.78,66.76 R21.2 35.2,66.73 v1(35.2,65.73) ; 36.78,66.76 37.51,66.76 37.59,66.84 ; v1(24.99,79.18) v1(24.99,77.93) 25.32,77.6 U4.5 ; v1(24.99,79.18) 24.88,79.06 C28.2 v1(21.99,79.06) v1(20.67,79.06) v1(19.2,79.06) ; v1(24.99,79.18) 24.99,80.49 v1(24.7,80.78) C31.2 20.74,80.78 20.32,81.2 20.32,85.72 20.73,86.13 23.48,86.13 C30.2 24.32,86.15 v1(24.66,85.8) 24.66,85.57 24.87,85.37 v1(25.73,85.37) v1(26.57,84.53) v1(26.57,83.03) 26.59,83.01 v1(26.59,81.2) v1(26.59,79.22) 26.87,78.94 v1(28.06,78.94) 30.1,78.94 ; X1.2 21.26,74.37 21.25,74.35 ; C12.2 v1(27.69,70.56) ; v1(7.92,29.95) 7.95,29.97 7.95,31.18 9.64,31.18 9.69,31.13 ; v1(19.2,79.06) 18.28,79.06 v1(17.86,78.64) v1(17.86,76.85) 17.86,74.68 18.19,74.35 v1(18.88,74.35) v1(20.66,74.35) 21.25,74.35 ; v1(19.2,79.06) 19.2,77.77 X1.4 ; U4.0 U4.0 37.4,78.4 U4.49 ; 21.25,74.35 v1(21.99,74.35) 23.25,74.35 C29.1 24.09,74.53 24.36,74.8 24.36,76.1 24.54,76.28 v1(25.66,76.28) v1(28.52,76.28) ; v1(11.56,19.48) 11.56,20.22 R1.1 ; v1(11.58,16.38) 11.58,16.39 R2.1 ; 38.99,79.83 v1(39.27,79.83) v1(40.06,79.83) 40.36,79.83 v1(40.69,80.16) v1(41.27,80.74) v1(41.92,81.39) v1(42.43,81.91) v1(42.99,82.46) v1(43.56,83.03) v1(44.19,83.66) v1(44.81,84.28) v1(45.47,84.95) v1(46.22,85.69) v1(46.89,86.36) v1(47.6,87.07) v1(48.37,87.84) v1(49.04,88.51) v1(49.83,89.3) v1(50.57,90.04) v1(51.22,90.7) v1(52.07,91.54) v1(52.88,92.35) 53.34,92.81 v1(54.06,92.81) v1(55.42,92.81) 56.19,92.81 v1(56.44,93.07) v1(56.44,94.06) ; 37.59,66.84 C15.2 38.48,65.81 v1(38.51,65.79) ; 41.1,79.17 41.45,79.17 v1(41.67,79.39) v1(42.29,80.01) v1(42.99,80.7) v1(43.6,81.32) v1(44.32,82.04) v1(44.86,82.58) v1(45.6,83.32) v1(46.16,83.88) v1(46.93,84.65) v1(47.53,85.25) v1(48.38,86.1) v1(49.04,86.76) v1(49.73,87.45) v1(50.47,88.19) v1(51.25,88.96) v1(51.85,89.56) v1(52.57,90.28) v1(53.26,90.98) v1(53.9,91.62) v1(55.17,91.62) v1(56.05,91.62) v1(57.1,91.62) v1(57.67,92.19) 58.66,93.18 58.66,94.03 ; R22.2 19.27,96.44 v1(18.8,95.96)
  Top Layer w0.508: v1(15.62,35.1) 15.59,35.13 R6.1 ; C5.2 15.54,36.87 v1(15.57,36.84) ; C6.1 6.96,52.15 v1(6.99,52.18) ; v1(17.41,27.32) 17.44,27.35 U1.1 ; v1(14.55,39.55) 14.56,39.55 C8.1 ; CN1.4 1.93,33.07 v1(1.24,33.76) ; 64.84,28.11 66.2,28.11 v1(66.23,28.08) ; v1(8.89,15.77) 8.86,15.8 7.5,15.8 ; 19.2,28.44 20.16,28.44 v1(20.17,28.42) ; v1(62.52,38.53) 62.49,38.56 61.12,38.56 ; U1.3 18.8,31.26 v1(18.83,31.23) ; v1(8.76,52.11) 8.73,52.08 8.73,50.72 ; 5.76,28.69 7.99,28.69 v1(8.36,29.06) ; 18.53,26.62 17.17,26.62 v1(17.14,26.65) ; SW3.4 69.37,40.47 v1(69.4,40.44) ; v1(18.72,39.52) 18.71,39.53 C9.2 ; v1(58.25,48.89) 58.28,48.86 SW2.3 ; v1(69.34,48.83) 69.31,48.86 67.95,48.86 ; SW4.4 68,30.78 v1(67.98,30.75) ; v1(1.91,25.2) 1.93,25.23 CN1.3 ; v1(61.85,28.45) 61.88,28.42 63.24,28.42 ; v1(58.21,40.5) 58.24,40.47 59.6,40.47 ; U3.1 14.71,46.91 v1(14.74,46.88) ; v1(58.21,32.17) 58.24,32.14 59.6,32.14
  Bottom Layer w0.254: v1(38.51,65.79) 38.48,65.79
  vias: v1(1.27,58.45) v1(1.3,57.45) v1(2.09,58.45) v1(2.11,57.45) v1(2.95,57.45) v1(2.99,58.45) v1(3.81,58.45) v1(3.94,57.45) v1(4.93,83.64) v1(4.9,68.43) v1(4.93,67.44) v1(4.9,64.47) v1(4.93,63.47) v1(4.95,82.65) v1(5,77.8) v1(5.03,76.81) v1(5.03,73.03) v1(5.05,72.03) v1(5.21,86.84) v1(5.23,85.85) v1(5.73,68.43) v1(5.75,67.44) v1(5.73,64.47) v1(5.75,63.47) v1(5.75,83.64) v1(5.77,82.65) v1(5.83,77.8) v1(5.85,76.81) v1(5.85,73.03) v1(5.87,72.03) v1(6.03,86.84) v1(6.05,85.85) v1(6.64,83.64) v1(6.61,82.65) v1(6.62,68.43) v1(6.58,67.44) v1(6.62,64.47) v1(6.58,63.47) v1(6.72,77.8) v1(6.68,76.81) v1(6.75,73.03) v1(6.71,72.03) v1(6.92,86.84) v1(6.89,85.85) v1(7.44,68.43) v1(7.44,64.47) v1(7.47,83.64) v1(7.55,77.8) v1(7.6,82.65) v1(7.57,73.03) v1(7.58,67.44) v1(7.58,63.47) v1(7.75,86.84) v1(7.68,76.81) v1(7.7,72.03) v1(7.88,85.85) v1(9.58,58.78) v1(9.6,57.78) v1(10.4,58.78) v1(10.42,57.78) v1(11.29,58.78) v1(11.25,57.78) v1(11.89,51.71) v1(11.91,50.72) v1(12.12,58.78) v1(12.25,57.78) v1(12.71,51.71) v1(12.73,50.72) v1(13.6,51.71) v1(13.57,50.72) v1(14.43,51.71) v1(14.56,50.72) v1(17.25,85.09) v1(17.25,84.27) v1(17.25,83.38) v1(17.25,82.55) v1(17.86,74.93) v1(18.24,85.22) v1(18.24,84.23) v1(18.24,83.39) v1(18.24,82.58) v1(23.39,93.93) v1(23.42,92.94) v1(24.08,60.57) v1(24.05,57.84) v1(24.22,93.93) v1(24.24,92.94) v1(25.11,93.93) v1(25.07,92.94) v1(25.94,93.93) v1(26.07,92.94) v1(28.7,86.28) v1(28.73,85.29) v1(29.53,86.28) v1(29.55,85.29) v1(30.42,86.28) v1(30.38,85.29) v1(31.24,86.28) v1(31.37,85.29) v1(33.83,93) v1(33.86,92.01) v1(34.66,93) v1(34.68,92.01) v1(35.55,93) v1(35.51,92.01) v1(35.48,63.63) v1(35.51,62.64) v1(36.31,63.63) v1(36.33,62.64) v1(36.37,93) v1(36.5,92.01) v1(37.2,63.63) v1(37.16,62.64) v1(38.03,63.63) v1(38.16,62.64) v1(39.85,83.64) v1(39.88,82.65) v1(40.03,98.37) v1(40.06,97.38) v1(40.26,96.32) v1(40.28,95.33) v1(40.31,85.8) v1(40.34,84.81) v1(40.39,94.06) v1(40.41,93.07) v1(40.68,83.64) v1(40.7,82.65) v1(40.86,98.37) v1(40.87,97.38) v1(40.87,92.08) v1(40.89,91.08) v1(40.87,88.32) v1(40.89,87.33) v1(41.08,96.32) v1(41.1,95.33) v1(41.13,85.8) v1(41.21,94.06) v1(41.23,93.07) v1(41.15,84.81) v1(41.28,90.3) v1(41.3,89.31) v1(41.53,82.65) v1(41.57,83.64) v1(41.75,98.37) v1(41.71,97.38) v1(41.69,92.08) v1(41.71,91.08) v1(41.69,88.32) v1(41.71,87.33) v1(41.94,95.33) v1(41.97,96.32) v1(42.03,85.8) v1(41.99,84.81) v1(42.1,94.06) v1(42.06,93.07) v1(42.1,90.3) v1(42.12,89.31) v1(42.39,83.64) v1(42.55,91.08) v1(42.55,87.33) v1(42.53,82.65) v1(42.57,98.37) v1(42.58,92.08) v1(42.58,88.32) v1(42.7,97.38) v1(42.8,96.32) v1(42.93,95.33) v1(42.93,94.06) v1(42.85,85.8) v1(42.99,90.3) v1(42.95,89.31) v1(42.98,84.81) v1(43.06,93.07) v1(43.33,61.72) v1(43.41,92.08) v1(43.41,88.32) v1(43.36,60.73) v1(43.54,91.08) v1(43.54,87.33) v1(43.64,67.87) v1(43.66,66.88) v1(43.82,90.3) v1(43.95,89.31) v1(44.16,61.72) v1(44.18,60.73) v1(44.27,64.87) v1(44.3,63.88) v1(44.46,67.87) v1(44.48,66.88) v1(44.73,92.1) v1(44.75,91.11) v1(45.03,88.95) v1(45.05,61.72) v1(45.01,60.73) v1(45.06,87.96) v1(45.1,64.87) v1(45.12,63.88) v1(45.32,66.88) v1(45.35,67.87) v1(45.55,92.1) v1(45.57,91.11) v1(45.86,88.95) v1(45.88,87.96) v1(45.87,61.72) v1(45.99,64.87) v1(45.95,63.88) v1(46,60.73) v1(46.18,67.87) v1(46.31,66.88) v1(46.45,92.1) v1(46.41,91.11) v1(46.58,83.19) v1(46.71,87.96) v1(46.71,82.19) v1(46.75,88.95) v1(46.81,64.87) v1(46.94,63.88) v1(47.12,78.75) v1(47.12,76.17) v1(47.27,92.1) v1(47.4,91.11) v1(47.53,82.19) v1(47.58,88.95) v1(47.57,83.19) v1(47.71,87.96) v1(48.34,85.04) v1(48.36,92.35) v1(48.39,91.36) v1(48.36,84.05) v1(48.41,83.19) v1(48.43,82.19) v1(49.19,92.35) v1(49.21,91.36) v1(49.16,85.04) v1(49.18,84.05) v1(49.22,83.19) v1(49.25,82.19) v1(50.04,91.36) v1(50.01,84.05) v1(50.08,92.35) v1(50.05,85.04) v1(50.57,87) v1(50.6,86) v1(50.9,92.35) v1(50.88,85.04) v1(51.03,91.36) v1(51.01,84.05) v1(51.08,79.88) v1(51.1,78.89) v1(51.4,87) v1(51.42,86) v1(51.46,69.72) v1(51.49,68.73) v1(51.9,79.88) v1(51.92,78.89) v1(52.25,86) v1(52.2,66.65) v1(52.22,65.66) v1(52.29,87) v1(52.29,69.72) v1(52.3,68.73) v1(52.58,89) v1(52.6,88.01) v1(52.8,79.88) v1(52.76,78.89) v1(52.76,63.19) v1(52.78,62.2) v1(52.86,84.76) v1(52.88,83.77) v1(53.02,66.65) v1(53.04,65.66) v1(53.11,87) v1(53.14,68.73) v1(53.24,86) v1(53.18,69.72) v1(53.4,89) v1(53.42,88.01) v1(53.62,79.88) v1(53.58,63.19) v1(53.6,62.2) v1(53.68,84.76) v1(53.7,83.77) v1(53.75,78.89) v1(53.91,66.65) v1(53.88,65.66) v1(54,69.72) v1(54.13,68.73) v1(54.29,89) v1(54.26,88.01) v1(54.43,62.2) v1(54.54,83.77) v1(54.47,63.19) v1(54.56,90.88) v1(54.58,89.89) v1(54.57,84.76) v1(54.74,66.65) v1(54.91,86.77) v1(54.94,85.78) v1(54.87,65.66) v1(55.12,89) v1(55.25,88.01) v1(55.3,63.19) v1(55.38,90.88) v1(55.4,89.89) v1(55.4,84.76) v1(55.43,62.2) v1(55.53,83.77) v1(55.74,86.77) v1(55.76,85.78) v1(56.13,79.63) v1(56.24,89.89) v1(56.16,78.64) v1(56.28,90.88) v1(56.57,88.24) v1(56.59,87.25) v1(56.63,86.77) v1(56.59,85.78) v1(56.59,83.74) v1(56.62,82.75) v1(56.96,79.63) v1(56.98,78.64) v1(57.1,90.88) v1(57.23,89.89) v1(57.39,88.24) v1(57.41,87.25) v1(57.42,83.74) v1(57.44,82.75) v1(57.46,86.77) v1(57.59,85.78) v1(57.85,79.63) v1(57.81,78.64) v1(57.84,61.19) v1(57.86,60.2) v1(58.24,87.25) v1(58.29,90.07) v1(58.32,89.08) v1(58.28,88.24) v1(58.31,83.74) v1(58.27,82.75) v1(58.68,79.63) v1(58.66,61.19) v1(58.68,60.2) v1(58.75,92.1) v1(58.78,91.11) v1(58.81,78.64) v1(59.12,90.07) v1(59.14,89.08) v1(59.11,88.24) v1(59.13,83.74) v1(59.24,87.25) v1(59.26,82.75) v1(59.51,60.2) v1(59.58,92.1) v1(59.59,91.11) v1(59.55,61.19) v1(60.01,90.07) v1(59.97,89.08) v1(60.43,91.11) v1(60.38,61.19) v1(60.47,92.1) v1(60.51,60.2) v1(60.83,90.07) v1(60.97,89.08) v1(61.29,92.1) v1(61.42,91.11) v1(61.65,87.25) v1(61.67,86.26) v1(62.47,87.25) v1(62.49,86.26) v1(63.32,86.26) v1(63.36,87.25) v1(64.19,87.25) v1(64.32,86.26) v1(67.54,71.35) v1(67.54,70.52) v1(67.54,69.63) v1(67.54,68.81) v1(67.64,62.26) v1(67.64,61.43) v1(67.64,60.54) v1(67.64,59.72) v1(67.69,88.62) v1(67.69,87.8) v1(67.69,86.91) v1(67.69,86.08) v1(67.82,79.2) v1(67.82,78.37) v1(67.82,77.48) v1(67.82,76.66) v1(68.53,71.48) v1(68.53,70.49) v1(68.53,69.65) v1(68.53,68.83) v1(68.63,62.39) v1(68.63,61.39) v1(68.63,60.56) v1(68.63,59.74) v1(68.68,88.75) v1(68.68,87.76) v1(68.68,86.92) v1(68.68,86.11) v1(68.81,79.33) v1(68.81,78.34) v1(68.81,77.5) v1(68.81,76.68)
VBAT: length 4.1
  Top Layer w0.508: R5.2 8.38,35.13 7.92,34.67 7.92,32.6 7.95,32.58
  vias: v1(4.6,32.84) v1(4.58,31.94) v1(5.45,32.84) v1(5.51,31.94) v1(6.42,32.84) v1(6.42,31.94) v1(17.25,23.8) v1(17.22,23) v1(17.22,22.1) v1(18.12,23.8) v1(18.12,23) v1(18.12,22.1)
VBUS:
  vias: v1(11.07,27.89) v1(11.07,27.11) v1(11.07,26.2) v1(17.04,33.3) v1(17.84,33.3) v1(18.66,33.3)
VIN: length 35.6
  Top Layer w0.203: U6.8 49.02,30.33 48.75,30.06 U11.1
  Top Layer w0.508: U11.1 47.71,30.02 46.38,30.02 45.52,29.16 42.47,29.16 41.94,28.63 v1(41.94,28.1) v1(41.94,27.44) v1(41.94,26.72) R17.1 ; J3.1 42.33,14.83 D7.1 42.29,14.9 v1(42.29,16.78) v1(42.29,17.53)
  Bottom Layer w0.508: v1(42.32,16.03) 42.29,16.05 v1(42.29,16.78) v1(42.29,17.53) 42.29,17.83 41.94,18.19 v1(41.94,26.72) v1(41.94,27.44) v1(41.94,28.1)
VINTA: length 4.1
  Top Layer w0.152: U4.50 43.11,78.8 43.12,78.79
ADC_VBAT: length 71.3
  Top Layer w0.152: v1(30.4,49.91) 30.2,49.91 29.46,50.65 29.46,63.34 26.49,66.32 17.78,66.32 16.36,67.74 16.36,69.57 16.56,69.77 R25.1 R26.1 ; C5.1 12.77,38.22 12.98,38.43 v1(19.25,38.43)
  Top Layer w0.508: C5.1 12.77,35.18 R6.2 R5.1
  Bottom Layer w0.152: v1(19.25,38.43) 19.25,48.68 20.16,49.58 30.07,49.58 v1(30.4,49.91)
ADC_VOLTAGE: length 49.6
  Top Layer w0.152: v1(35.53,54.89) 32.72,54.89 32.28,55.32 32.28,66.57 32.66,66.95 R27.1 R28.1 ; v1(35.61,34.04) 36.69,34.04 U12.4 ; U12.3 v1(36.72,38.58)
  Bottom Layer w0.152: v1(35.61,34.04) 35.61,38.2 35.97,38.56 36.69,38.56 v1(36.72,38.58) 37.18,39.04 40.06,39.04 40.39,39.37 40.39,54.56 40.06,54.89 v1(35.53,54.89)
ANT: length 25.2
  Top Layer w0.152: U4.51 40.59,79.2 53.62,92.23 56.87,92.23 57.18,92.53 57.18,94.03
BOOT0: length 45.1
  Top Layer w0.152: R22.1 18.85,98.72 SW1.3 ; SW1.3 16.82,97.14 v1(16.81,97.13) ; SW1.3 SW1.4 ; v1(19.46,89.69) 19.53,89.61 31.71,89.61 33.8,87.52 U4.63
  Bottom Layer w0.152: v1(16.81,97.13) 17.14,96.8 19.18,96.8 19.46,96.52 v1(19.46,89.69)
BOOT1: length 4
  Top Layer w0.152: R21.1 35.18,69.55 35.8,70.17 U4.28
BUZZER: length 69
  Top Layer w0.152: R11.1 58.83,29.97 56.24,32.56 56.24,51.89 55.52,52.6 37.14,52.6 36.75,52.99 36.75,53.92 36.45,54.23 32.31,54.23 31.88,54.66 31.88,69.06 32.54,69.72 33.32,69.72 33.8,70.2 U4.23
CC1: length 2.5
  Top Layer w0.152: 10,20.27 9.98,20.25 USB1.A5
CC2: length 2.6
  Top Layer w0.152: USB1.B5 10.04,17.25 R2.2
CHRG: length 109
  Top Layer w0.152: v1(28.19,47.98) 28.23,48.02 28.23,63.28 26.43,65.09 17.5,65.09 15.28,67.31 15.28,87.36 16.3,88.38 31.37,88.38 32.6,87.15 U4.66 ; U1.7 11.08,29.99 v1(11.07,29.99)
  Bottom Layer w0.152: v1(28.19,47.98) 20.76,47.98 20.29,47.52 20.29,34.52 19.96,34.19 16.51,34.19 12.31,29.99 v1(11.07,29.99) 11.07,29.97
HOLD: length 72.1
  Top Layer w0.152: 59.62,44.99 59.6,44.97 ; 59.62,44.99 C33.2 57.25,46.91 56.87,47.3 56.87,53.67 56.49,54.05 37.87,54.05 37.67,54.25 v1(37.16,54.25) ; 59.62,44.99 67.98,44.99 SW3.2 ; v1(32.89,50.67) 30.35,50.67 29.87,51.16 29.87,69.72 31.8,71.65 U4.18
  Bottom Layer w0.152: v1(32.89,50.67) 32.92,50.7 32.92,53.9 33.27,54.25 v1(37.16,54.25)
INA_SCL: length 124.9
  Top Layer w0.152: U4.61 34.6,87.88 31.81,90.67 15.35,90.67 12.99,88.31 12.99,66.36 15.84,63.51 25.49,63.51 26.68,62.32 26.68,51.39 26.44,51.16 24.94,51.16 24.61,50.83 24.61,47.35 25.07,46.89 47.87,46.89 48.02,46.74 U6.5 48.02,35.49 48.31,35.2 50.19,35.2 51,34.39 R18.1
INA_SDA: length 122
  Top Layer w0.152: U4.62 34.2,87.71 31.64,90.27 15.51,90.27 13.39,88.14 13.39,66.53 16.01,63.91 25.65,63.91 27.08,62.48 27.08,51.13 26.77,50.83 25.37,50.83 25.12,50.57 25.12,47.55 25.35,47.32 48.37,47.32 48.52,47.17 U6.4 48.52,36.21 48.87,35.86 R19.1
LCD_BLK: length 34.9
  Top Layer w0.152: U4.43 39.6,76 40.26,75.34 v1(60.4,75.34)
  Bottom Layer w0.152: 64.6,66.11 64.59,66.12 60.71,66.12 60.4,66.42 v1(60.4,75.34)
LCD_CS: length 29
  Top Layer w0.152: v1(61.77,71.96) 60.93,72.8 U4.35
  Bottom Layer w0.152: 64.6,68.65 64.56,68.61 62.41,68.61 61.77,69.24 v1(61.77,71.96)
LCD_DC: length 27.1
  Top Layer w0.152: 64.6,71.19 64.56,71.15 38.43,71.15 38.2,71.38 U4.34
LCD_RES: length 25.7
  Top Layer w0.152: U4.37 64.47,73.6 64.6,73.73
LCD_SCL: length 31.5
  Top Layer w0.152: v1(62.31,72.8) 61.9,73.2 U4.36
  Bottom Layer w0.152: 64.6,78.81 64.5,78.71 62.76,78.71 62.31,78.26 v1(62.31,72.8)
LCD_SDA: length 26.6
  Top Layer w0.152: 64.6,76.27 62.33,74 U4.38
LINK_RX: length 36.6
  Top Layer w0.152: 42.85,76.4 42.85,76.4 ; 42.85,76.4 U4.44 ; 42.85,76.4 43.06,76.4 v1(43.49,75.97)
  Bottom Layer w0.152: v1(43.49,75.97) 43.05,76.4 38.53,76.4 37.34,77.6 37.34,93.52 36.42,94.44 32.31,94.44 31.88,94.87 H5.5
LINK_TX: length 36.4
  Top Layer w0.152: U4.45 43.77,76.8 v1(44.55,76.02)
  Bottom Layer w0.152: H5.6 34.39,98.02 34.39,95.28 34.67,95 37.03,95 37.77,94.26 37.77,77.83 38.79,76.81 43.76,76.81 v1(44.55,76.02)
MODE: length 77
  Top Layer w0.152: v1(37.57,53.39) 55.85,53.39 56.57,52.68 56.57,39.01 57.02,38.56 C34.2 59.62,36.66 ; U4.19 32.2,71.21 32.08,71.09 31.78,71.09 30.28,69.6 30.28,51.94 30.86,51.36 v1(34.59,51.36) ; SW4.2 67.98,36.66 59.62,36.66 ; 59.62,36.66 59.6,36.64
  Bottom Layer w0.152: v1(34.59,51.36) 34.57,51.38 34.57,53.14 34.82,53.39 v1(37.57,53.39)
NRST: length 101.2
  Top Layer w0.152: v1(41.15,48.26) 29.57,48.26 28.68,49.15 28.68,63.27 26.41,65.53 17.53,65.53 15.65,67.41 15.65,73.48 15.82,73.66 24.54,73.66 25.04,74.17 25.04,75.39 25.37,75.72 28.8,75.72 29.49,76.4 U4.8 ; 59.65,53.37 SW2.1 ; 59.65,53.37 59.66,53.36 SW2.2 ; 59.65,53.37 C32.2 59.6,55.4 v1(41.12,55.4)
  Bottom Layer w0.152: v1(41.15,48.26) 41.15,55.37 v1(41.12,55.4)
OSC32IN: length 15.1
  Top Layer w0.152: U4.3 31,78.38 26.47,78.38 25.98,78.87 25.98,83.97 25.21,84.75 C30.1 23.49,84.74 X2.2
OSC32OUT: length 13.1
  Top Layer w0.152: X2.1 23.39,82.24 C31.1 23.46,82.19 25.35,82.19 25.58,81.97 25.58,78.71 26.29,78 U4.4 31.03,78.02
OSC_IN: length 10
  Top Layer w0.152: X1.3 23.45,77.64 23.47,77.66 23.93,77.2 U4.6 31.03,77.22
OSC_OUT: length 13.1
  Top Layer w0.152: X1.1 19.96,76.78 22.59,76.78 C29.2 24.31,76.8 U4.7 31.03,76.82
REF: length 33.1
  Top Layer w0.152: v1(25.5,30.18) 25.49,30.16 U7.3 ; U6.9 v1(49.52,34.59)
  Bottom Layer w0.152: v1(25.5,30.18) 25.5,29.18 25.76,28.93 49.02,28.93 49.53,29.44 49.53,34.59 v1(49.52,34.59)
RES: length 123.4
  Top Layer w0.152: 54.46,31.78 57.1,29.14 57.1,24.59 56.47,23.95 51.21,23.95 49.33,22.07 49.33,17.98 49.47,17.84 R7.1 ; 54.43,31.78 54.43,48.41 53.65,49.2 30,49.2 29.06,50.14 29.06,63.32 26.46,65.91 17.6,65.91 15.95,67.56 15.95,71.65 16.54,72.24 R23.1 R24.1 ; 55.01,17.84 R10.1
  Top Layer w0.508: D3.2 58.44,17.84 C17.2 ; D3.2 R7.1 ; D3.2 56.71,15.41 D2.1 56.78,8.22 J4.1
RES_1: length 154.4
  Top Layer w0.152: v1(26.44,50.32) 27.18,50.32 27.43,50.57 27.43,63.22 26.37,64.29 17.17,64.29 14.48,66.98 14.48,87.69 15.97,89.18 31.71,89.18 33.4,87.49 U4.64 ; R7.2 50.35,22.36 51.64,23.65 56.59,23.65 57.51,24.56 57.51,29.31 54.86,31.95 54.86,49.02 v1(51.94,51.94)
  Bottom Layer w0.152: v1(51.94,51.94) 51.94,56.64 51.46,57.12 26.92,57.12 26.44,56.64 v1(26.44,50.32)
RES_2: length 150.1
  Top Layer w0.152: U4.60 35,88.04 31.97,91.07 15.18,91.07 12.59,88.47 12.59,66.2 15.68,63.11 25.32,63.11 26.28,62.15 26.28,57.26 v1(25.22,56.21) ; R8.2 51.93,22.89 52.35,23.32 56.69,23.32 57.86,24.49 57.86,29.45 55.22,32.1 55.22,49.53 v1(52.81,51.94)
  Bottom Layer w0.152: v1(25.22,56.21) 26.64,57.63 52.38,57.63 52.81,57.2 v1(52.81,51.94)
RES_3: length 149.6
  Top Layer w0.152: U4.59 35.4,88.21 32.14,91.47 15.02,91.47 12.19,88.64 12.19,66.03 15.51,62.71 25.16,62.71 25.88,61.99 25.88,57.96 v1(25.22,57.3) ; R9.2 53.48,22.51 53.97,23.01 56.82,23.01 58.19,24.38 58.19,29.59 55.55,32.23 55.55,50.11 v1(53.75,51.92)
  Bottom Layer w0.152: v1(25.22,57.3) 26.01,58.09 53.19,58.09 53.75,57.53 v1(53.75,51.92)
RES_4: length 149.7
  Top Layer w0.152: v1(25.17,58.27) 25.48,58.57 25.48,61.82 24.99,62.31 15.34,62.31 11.79,65.86 11.79,88.81 14.85,91.87 32.3,91.87 35.8,88.38 U4.58 ; v1(54.79,51.94) 55.88,50.85 55.88,32.41 58.55,29.74 58.55,24.31 56.94,22.71 55.45,22.71 55.03,22.28 R10.2
  Bottom Layer w0.152: v1(25.17,58.27) 25.53,58.62 54.28,58.62 54.79,58.11 v1(54.79,51.94)
SEL_CURRENT: length 63.9
  Top Layer w0.152: U11.6 51.24,30.06 51.49,30.3 51.46,30.33 v1(51.46,33.43) ; v1(41.81,51.99) 41.78,51.97 31.29,51.97 30.66,52.6 30.66,69.44 31.98,70.76 32.36,70.76 32.6,71 U4.20
  Bottom Layer w0.152: v1(41.81,51.99) 50.8,51.99 51.46,51.33 v1(51.46,33.43)
SEL_OF: length 59.1
  Top Layer w0.152: U4.33 37.8,69.84 38.46,69.19 40.13,69.19 40.54,68.78 40.54,56.87 39.9,56.24 v1(33.07,56.24) ; v1(29.77,37.26) 29.46,36.96 29.46,26.49 29.33,26.36 U7.6
  Bottom Layer w0.152: v1(29.77,37.26) 29.77,39.14 31.39,40.77 31.39,55.88 31.75,56.24 v1(33.07,56.24)
SEL_VOLTAGE_0: length 42.7
  Top Layer w0.152: U4.21 33,70.64 32.77,70.41 32.16,70.41 31.01,69.27 31.01,53.49 31.78,52.73 v1(32.03,52.73) ; U8.6 28.93,34.03 29.03,34.14 29.03,37.59 v1(30.4,38.96)
  Bottom Layer w0.152: v1(32.03,52.73) 32.06,52.7 32.16,52.7 32,52.55 32,40.56 v1(30.4,38.96)
SEL_VOLTAGE_1: length 54
  Top Layer w0.152: U9.6 v1(33.76,34.06) ; U4.22 33.4,70.31 33.15,70.05 32.36,70.05 31.47,69.16 31.47,54.15 32.84,52.78 v1(35.92,52.78) ; U10.6 v1(39.65,41.6)
  Bottom Layer w0.152: v1(33.76,34.06) 33.76,41.17 34.19,41.6 v1(39.65,41.6) 39.65,52.55 39.4,52.81 35.94,52.81 v1(35.92,52.78)
STDBY: length 109
  Top Layer w0.152: v1(27.36,48.97) 27.46,48.97 27.83,49.35 27.83,63.25 26.4,64.69 17.34,64.69 14.88,67.15 14.88,87.52 16.13,88.78 31.54,88.78 33,87.32 U4.65 ; U1.6 11.05,31.26 v1(11.05,31.26)
  Bottom Layer w0.152: v1(11.05,31.26) 12.79,31.26 16.23,34.7 19.63,34.7 19.79,34.85 19.79,48.25 20.51,48.97 v1(27.36,48.97)
SWCLK: length 28.8
  Top Layer w0.152: H5.3 26.77,98.02 26.77,94.77 27.36,94.18 37.72,94.18 38.2,93.7 U4.52
SWDIO: length 35.6
  Top Layer w0.152: U4.48 41.09,78 v1(41.38,78.28)
  Bottom Layer w0.152: 29.34,98.04 30.56,99.26 37.87,99.26 38.2,98.93 38.2,78.69 38.61,78.28 v1(41.38,78.28)
USB1DM: length 112.8
  Top Layer w0.152: 8.36,18.75 8.46,18.85 8.46,19.6 8.31,19.75 USB1.B7 ; 8.36,18.75 9.14,18.75 9.24,18.65 12.67,18.65 12.83,18.8 12.83,19.02 12.98,19.18 14.2,19.18 14.35,19.02 14.35,18.8 14.5,18.65 15.72,18.65 15.88,18.8 15.88,19.02 16.03,19.18 17.25,19.18 17.4,19.02 17.4,18.8 17.55,18.65 18.77,18.65 18.92,18.8 18.92,19.02 19.08,19.18 20.29,19.18 20.45,19.02 20.45,18.8 20.6,18.65 21.42,18.65 22.17,19.41 22.17,58.34 23.14,59.31 23.77,59.31 v1(24.08,59.61) ; 8.36,18.75 7.5,18.75 USB1.A7 ; U4.46 39.46,77.2 39.51,77.25 46.88,77.25 v1(47.12,77.01)
  Bottom Layer w0.152: v1(47.12,77.01) 47.14,77.01 47.42,77.29 48.54,77.29 48.72,77.11 48.72,59.74 48.31,59.33 24.71,59.33 24.44,59.61 v1(24.08,59.61)
USB1DP: length 112.7
  Top Layer w0.152: v1(47.12,77.9) 46.77,77.55 39.51,77.55 39.46,77.6 U4.47 ; USB1.A6 7.49,19.25 6.6,19.25 6.48,19.13 6.48,18.39 6.62,18.25 USB1.B6 9.14,18.25 9.24,18.34 21.54,18.34 22.48,19.28 22.48,58.22 23.27,59 23.8,59 v1(24.05,58.75)
  Bottom Layer w0.152: v1(47.12,77.9) 47.42,77.6 48.67,77.6 49.02,77.24 49.02,59.61 48.44,59.03 24.71,59.03 24.44,58.75 v1(24.05,58.75)
$1N2724: length 1.8
  Top Layer w0.152: 17.43,29.99 R3.2
$1N6482: length 10
  Top Layer w0.152: U9.4 30.95,35.07 31.14,35.25 38.41,35.25 38.63,35.48 38.63,36.59 U12.1
$1N6484: length 19.7
  Top Layer w0.508: U11.3 47.71,28.12 46.58,28.12 45.95,27.48 45.95,19.79 45.4,19.24 41.94,19.24 41.81,19.11 R16.1
$1N6487: length 53.2
  Top Layer w0.508: R16.2 36.21,25.3 v1(34.09,25.3) v1(33.31,25.3) v1(32.53,25.3) ; J1.1 17.34,12.34 D4.1 17.34,15.28 18.03,15.98 24.94,15.98 25.48,16.51 v1(25.48,21.74) 25.48,22.41 v1(25.49,22.42) 25.48,22.44 v1(25.48,23.11) 25.48,26.35 U7.4 25.45,26.4 25.45,27.28 24.46,28.27 24.46,30.56 25.47,31.56 U8.4
  Bottom Layer w0.152: v1(25.48,21.74) v1(25.48,23.11)
  Bottom Layer w0.508: 26.16,22.42 v1(25.49,22.42) ; 26.16,22.42 26.17,22.42 ; 26.16,22.42 arc(25.68,22.22) v1(25.48,21.74) ; 26.17,22.42 29.31,22.42 32.18,25.3 v1(32.53,25.3) v1(33.31,25.3) v1(34.09,25.3) ; 26.17,22.42 arc(25.68,22.63) v1(25.48,23.11)
$1N6488: length 47.9
  Top Layer w0.152: 30.61,14.93 D6.1 ; R15.1 42.88,41.52 C26.1
  Top Layer w0.508: J2.1 30.62,10.96 D6.1 30.62,29.53 31.22,30.12 42.16,30.12 42.85,30.81 42.85,41.42 C26.1
$1N6489: length 9.1
  Top Layer w0.152: U10.4 36.74,42.48 36.88,42.62 39.95,42.62 40.44,43.1 41.37,43.1 R15.2 41.41,43.06 C26.2 41.4,41.44 D5.2
$1N6490: length 3.8
  Top Layer w0.152: C24.1 28.68,38.75 R14.1 27.15,38 27.34,37.81 27.34,36.68
$1N6491: length 3.6
  Top Layer w0.152: 25.63,38.7 R13.1 ; 25.63,38.7 25.63,37.85 25.44,37.66 25.44,36.68 ; 25.63,38.7 24.13,38.7
$1N6508: length 19.8
  Top Layer w0.152: 28.72,40.26 30.94,40.26 ; 28.72,40.26 R14.2 25.68,40.26 R13.2 25.6,40.17 C23.2 ; 28.72,40.26 C24.2 ; 30.94,40.26 35.18,40.26 35.46,40.54 35.46,43.02 35.77,43.33 36.53,43.33 36.7,43.51 36.7,44.26 U10.3 ; 30.94,40.26 30.96,40.23 30.96,36.77 U9.3
$1N6517: length 12.6
  Top Layer w0.152: U10.1 38.66,44.29 38.66,43.15 38.51,43 36.32,43 35.87,42.55 35.87,40.23 35.43,39.8 33.12,39.8 32.85,39.53 U9.1
$1N9045: length 6.1
  Top Layer w0.203: U6.10 50.02,32.11 49.43,31.52 49.43,28.4 49.71,28.12 50.41,28.12 U11.4
$1N10212: length 10.3
  Top Layer w0.152: R23.2 24.66,72.24 25.37,72.95 25.37,75.08 25.65,75.36 28.98,75.36 29.62,76 U4.9
$1N10257: length 11.2
  Top Layer w0.152: U4.10 29.78,75.6 29.24,75.06 26.03,75.06 25.71,74.73 25.71,71.65 25.04,70.99 R24.2
$1N10302: length 12.1
  Top Layer w0.152: U4.11 29.89,75.2 29.44,74.75 26.54,74.75 26.16,74.37 26.16,70.28 25.65,69.77 R25.2
$1N10388: length 13
  Top Layer w0.152: R26.2 26.11,68.61 26.54,69.04 26.54,74.12 26.75,74.32 26.77,74.32 26.9,74.45 29.57,74.45 29.92,74.8 U4.12
$1N10482: length 4.2
  Top Layer w0.152: U4.24 34.2,70.01 32.66,68.48 R27.2
$1N10485: length 3.9
  Top Layer w0.152: R28.2 33.83,69.11 34.6,69.88 U4.25
$1N61600: length 6.6
  Top Layer w0.152: Q2.3 67.04,22.63 66.91,22.5
$1N61623: length 3.1
  Top Layer w0.152: R11.2 R12.2 64.8,29.97 64.84,30.01

## Copper pours and planes (outline as drawn; the poured copper is in the pictures)
3V3 on Top Layer: 10.44,48.16 10.54,48.26 11.61,48.26 11.61,42.78 12.02,42.37 18.23,42.37 18.41,42.19 18.41,40.52 18.34,40.44 13.62,40.44 12.78,39.6 9.3,39.6 9.09,39.8 9.09,42.09 9.5,42.49 10.08,42.49 10.44,42.85
+5V on Top Layer: 12.57,21.18 11.76,21.18 11.58,21.36 11.58,22.35 12.14,22.91 14.66,22.91 14.73,22.83 14.73,20.4 14.53,20.19 12.78,20.19 12.57,20.4
+5V on Bottom Layer: 14.53,20.19 14.73,20.4 14.73,21.62 14.28,22.07 14.25,22.07 13.39,22.94 10.54,22.94 3.71,29.77 3.71,34.19 7.31,37.8 7.31,46.79 6.5,47.6 1.37,47.6 1.04,47.27 1.04,45.06 1.32,44.78 5.21,44.78 5.51,44.48 5.51,38.96 2.06,35.71 1.93,35.59 1.93,29.54 11.25,20.22 14.5,20.22
AGND on Top Layer: 21.49,44.27 21.49,45.87 21.92,46.3 57.2,46.3 57.28,46.23 57.28,23.6 59.97,20.9 59.97,17.07 73.91,3.12 73.91,-1.4 -0.71,-1.4 -1.88,-0.23 -1.88,9.09 0.99,11.96 6.83,11.96 9.17,14.3 14.66,14.3 17.25,16.89 19.96,16.89 20.88,17.81 20.88,24.96 20.09,25.75 20.09,27.63 20.73,28.27 20.73,43.51
